# EAGLE design reLoaD_Base (EAGLE 9.7.0)
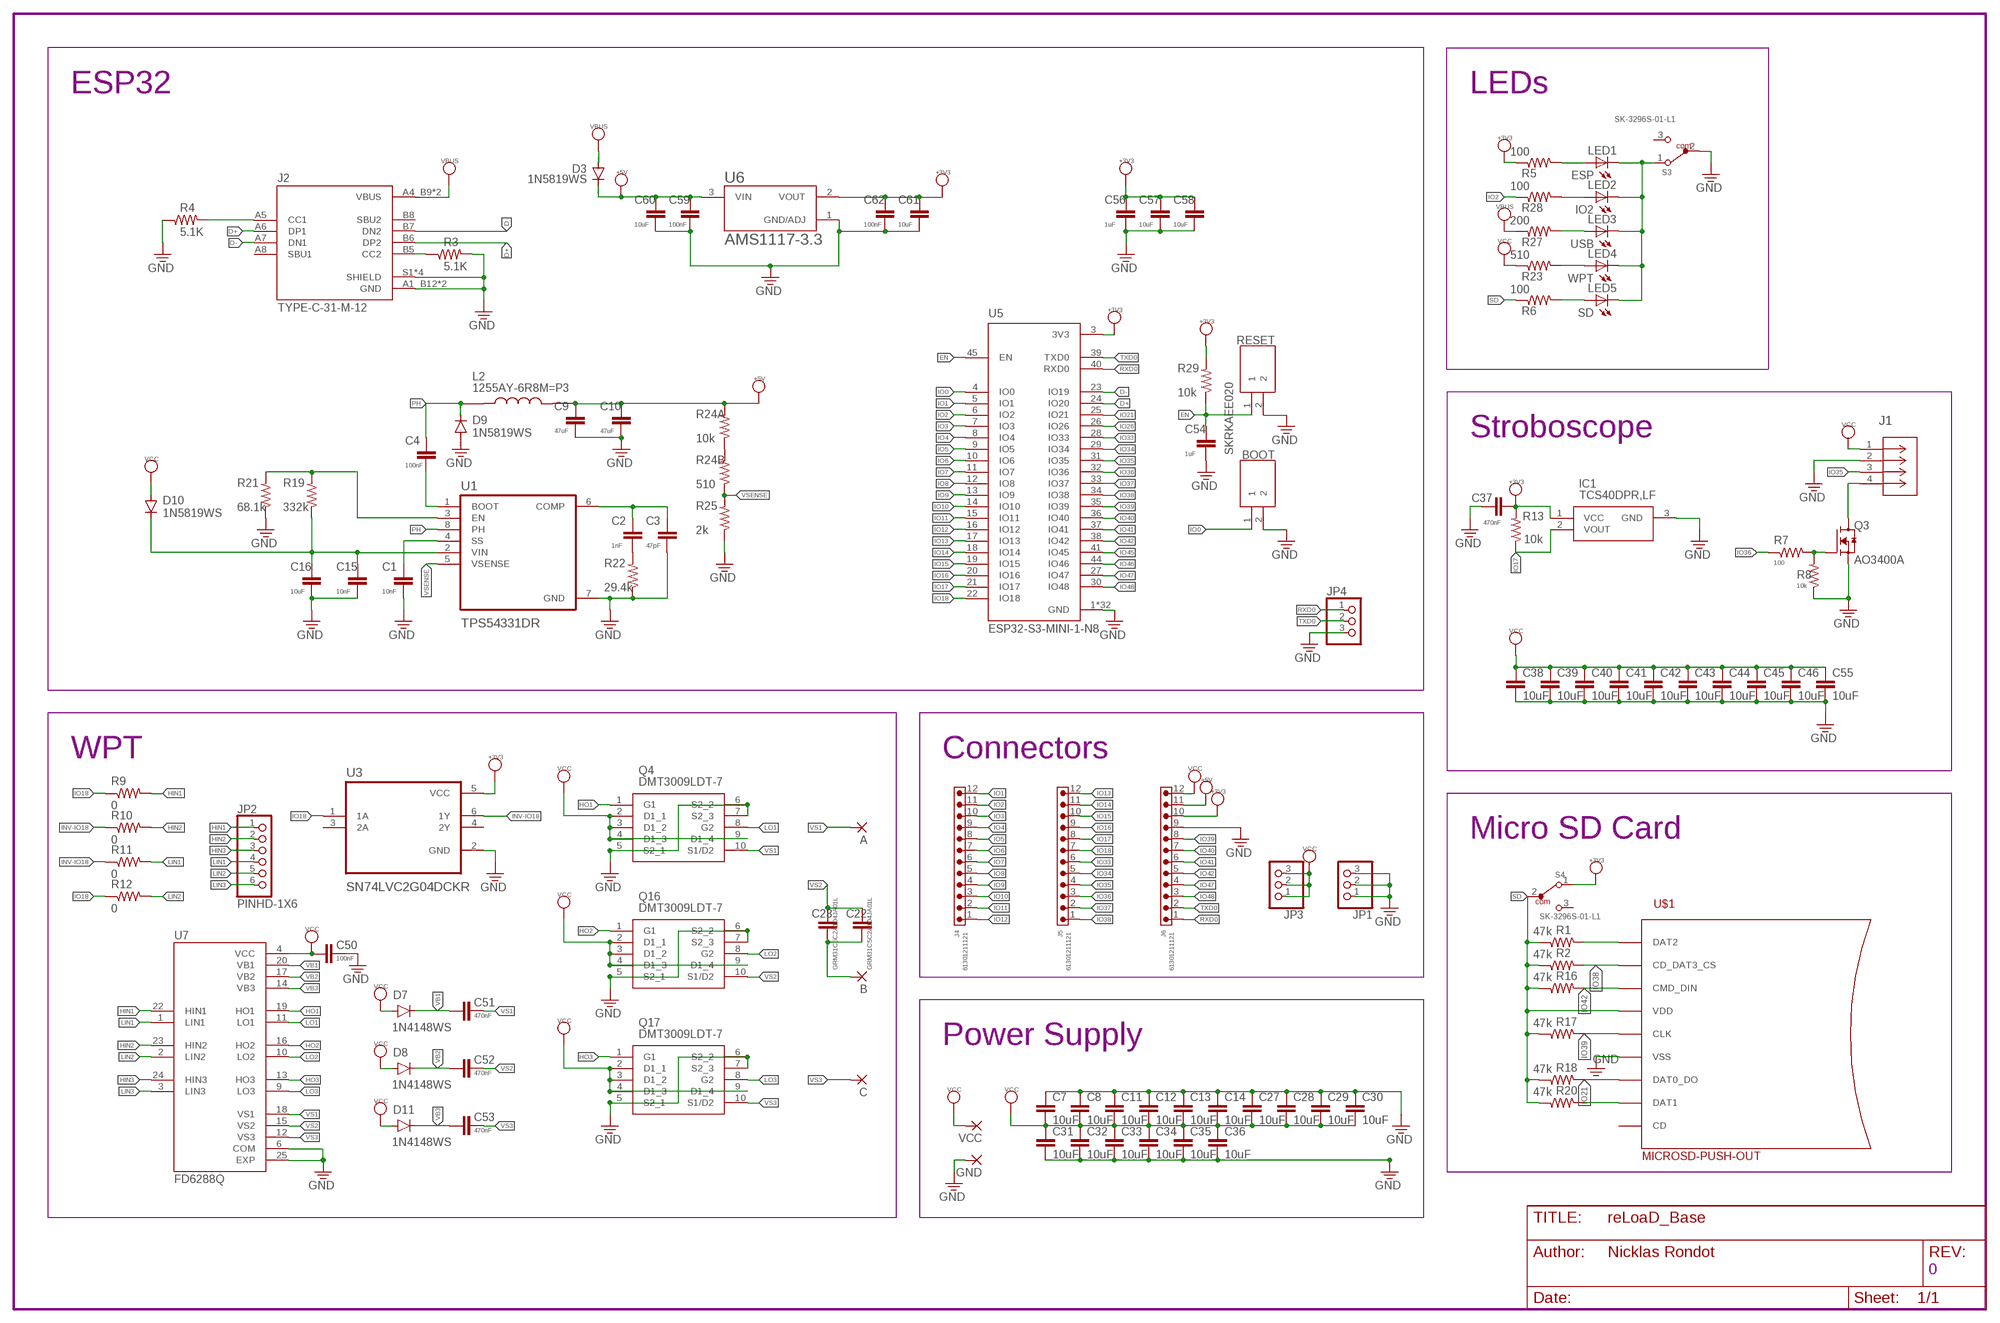
[diagram p0: schematic, sheet 1]

## Parts
A  3,81/1,4  [3,81/1,4]
B  3,81/1,4  [3,81/1,4]
BOOT  SKRKAEE020  [SKRKAEE020]
C  3,81/1,4  [3,81/1,4]
C1  10nF  C-EUC0603K  [C0603K]
C2  1nF  C-EUC0603K  [C0603K]
C3  47pF  C-EUC0603K  [C0603K]
C4  100nF  C-EUC0603K  [C0603K]
C7  10uF  C-EUC0805K  [C0805K]
C8  10uF  C-EUC0805K  [C0805K]
C9  47uF  C-EUC0603K  [C0603K]
C10  47uF  C-EUC0603K  [C0603K]
C11  10uF  C-EUC0805K  [C0805K]
C12  10uF  C-EUC0805K  [C0805K]
C13  10uF  C-EUC0805K  [C0805K]
C14  10uF  C-EUC0805K  [C0805K]
C15  10nF  C-EUC0603K  [C0603K]
C16  10uF  C-EUC0603K  [C0603K]
C22  GRM31C5C2A104JA01L  C-EUC1206K  [C1206K]
C23  GRM31C5C2A104JA01L  C-EUC1206K  [C1206K]
C27  10uF  C-EUC0805K  [C0805K]
C28  10uF  C-EUC0805K  [C0805K]
C29  10uF  C-EUC0805K  [C0805K]
C30  10uF  C-EUC0805K  [C0805K]
C31  10uF  C-EUC0805K  [C0805K]
C32  10uF  C-EUC0805K  [C0805K]
C33  10uF  C-EUC0805K  [C0805K]
C34  10uF  C-EUC0805K  [C0805K]
C35  10uF  C-EUC0805K  [C0805K]
C36  10uF  C-EUC0805K  [C0805K]
C37  470nF  C-EUC0603K  [C0603K]
C38  10uF  C-EUC0805K  [C0805K]
C39  10uF  C-EUC0805K  [C0805K]
C40  10uF  C-EUC0805K  [C0805K]
C41  10uF  C-EUC0805K  [C0805K]
C42  10uF  C-EUC0805K  [C0805K]
C43  10uF  C-EUC0805K  [C0805K]
C44  10uF  C-EUC0805K  [C0805K]
C45  10uF  C-EUC0805K  [C0805K]
C46  10uF  C-EUC0805K  [C0805K]
C50  100nF  C-EUC0603K  [C0603K]
C51  470nF  C-EUC0603K  [C0603K]
C52  470nF  C-EUC0603K  [C0603K]
C53  470nF  C-EUC0603K  [C0603K]
C54  1uF  C-EUC0603K  [C0603K]
C55  10uF  C-EUC0805K  [C0805K]
C56  1uF  C-EUC0603K  [C0603K]
C57  10uF  C-EUC0603K  [C0603K]
C58  10uF  C-EUC0603K  [C0603K]
C59  100nF  C-EUC0603K  [C0603K]
C60  10uF  C-EUC0603K  [C0603K]
C61  10uF  C-EUC0603K  [C0603K]
C62  100nF  C-EUC0603K  [C0603K]
D3  1N5819WS  DIODE-SOD323-W  [SOD323-W]
D7  1N4148WS  [SOD-323]
D8  1N4148WS  [SOD-323]
D9  1N5819WS  DIODE-SOD323-W  [SOD323-W]
D10  1N5819WS  DIODE-SOD323-W  [SOD323-W]
D11  1N4148WS  [SOD-323]
GND  3,81/1,4  [3,81/1,4]
IC1  TCS40DPR,LF  [SOTFL95P240X88-3N]
J1  S4B-XH-SM4-TBCONN4_S4B-XH_JST  [CONN4_S4B-XH_JST]
J2  TYPE-C-31-M-12  [HRO_TYPE-C-31-M-12]
J4  61301211121  6130XX11121_61301211121  [61301211121]
J5  61301211121  6130XX11121_61301211121  [61301211121]
J6  61301211121  6130XX11121_61301211121  [61301211121]
JP1  PINHD-1X3  [1X03]
JP2  PINHD-1X6  [1X06]
JP3  PINHD-1X3  [1X03]
JP4  PINHD-1X3  [1X03]
L2  1255AY-6R8M=P3  [IND_1255AY-6R8M=P3]
LED1  ESP  LEDCHIPLED_0805  [CHIPLED_0805]
LED2  IO2  LEDCHIPLED_0805  [CHIPLED_0805]
LED3  USB  LEDCHIPLED_0805  [CHIPLED_0805]
LED4  WPT  LEDCHIPLED_0805  [CHIPLED_0805]
LED5  SD  LEDCHIPLED_0805  [CHIPLED_0805]
Q3  AO3400A  [SOT95P280X125-3N]
Q4  DMT3009LDT-7  [DMT3009LDT7]
Q16  DMT3009LDT-7  [DMT3009LDT7]
Q17  DMT3009LDT-7  [DMT3009LDT7]
R1  47k  R-US_R0603  [R0603]
R2  47k  R-US_R0603  [R0603]
R3  5.1K  R-US_R0603  [R0603]
R4  5.1K  R-US_R0603  [R0603]
R5  100  R-US_R0603  [R0603]
R6  100  R-US_R0603  [R0603]
R7  100  R-US_R0603  [R0603]
R8  10k  R-US_R0603  [R0603]
R9  0  R-US_R0603  [R0603]
R10  0  R-US_R0603  [R0603]
R11  0  R-US_R0603  [R0603]
R12  0  R-US_R0603  [R0603]
R13  10k  R-US_R0603  [R0603]
R16  47k  R-US_R0603  [R0603]
R17  47k  R-US_R0603  [R0603]
R18  47k  R-US_R0603  [R0603]
R19  332k  R-US_R0603  [R0603]
R20  47k  R-US_R0603  [R0603]
R21  68.1k  R-US_R0603  [R0603]
R22  29.4k  R-US_R0603  [R0603]
R23  510  R-US_R0603  [R0603]
R24A  10k  R-US_R0603  [R0603]
R24B  510  R-US_R0603  [R0603]
R25  2k  R-US_R0603  [R0603]
R27  200  R-US_R0603  [R0603]
R28  100  R-US_R0603  [R0603]
R29  10k  R-US_R0603  [R0603]
RESET  SKRKAEE020  [SKRKAEE020]
S3  SK-3296S-01-L1  450404015514  [450404015514]
S4  SK-3296S-01-L1  450404015514  [450404015514]
U1  TPS54331DR  [SOIC127P599X175-8N]
U3  SN74LVC2G04DCKR  [SOT65P210X110-6N]
U5  ESP32-S3-MINI-1-N8  [XCVR_ESP32-S3-MINI-1-N8]
U6  AMS1117-3.3  [SOT229P700X180-4N]
U7  FD6288Q  [QFN50P400X400X90-25N]
U$1  MICROSD-PUSH-OUT  [MICROSD-PUSH-OUT]
VCC  3,81/1,4  [3,81/1,4]

## Nets
+3V3: C37.2 C56.1 C57.1 C58.1 C61.1 C62.1 IC1.1(VCC) J6.10 R5.1 R13.2 R29.2 S4.1 U3.5(VCC) U5.3(3V3) U6.2(VOUT)
+5V: C9.1 C10.1 C59.1 C60.1 D3.C J6.11 L2.2 R24A.2 U6.3(VIN)
COIL2R1: B.1(P) C22.1 C23.1
D+: J2.A6(DP1) J2.B6(DP2) U5.24(IO20)
D-: J2.A7(DN1) J2.B7(DN2) U5.23(IO19)
DAT2: R1.2 U$1.1(DAT2)
EN: C54.1 R29.1 RESET.1 U5.45(EN)
GND: BOOT.2 C1.2 C3.2 C7.1 C8.1 C9.2 C10.2 C11.1 C12.1 C13.1 C14.1 C15.2 C16.2 C27.1 C28.1 C29.1 C30.1 C31.2 C32.2 C33.2 C34.2 C35.2 C36.2 C37.1 C38.2 C39.2 C40.2 C41.2 C42.2 C43.2 C44.2 C45.2 C46.2 C50.1 C54.2 C55.2 C56.2 C57.2 C58.2 C59.2 C60.2 C61.2 C62.2 D9.A GND.1(P) IC1.3(GND) J1.2 J2.A1_B12(GND) J2.B1_A12(GND) J2.S1(SHIELD) J2.S2(SHIELD) J2.S3(SHIELD) J2.S4(SHIELD) J6.9 JP1.1 JP1.2 JP1.3 JP4.3 Q3.2(S) Q4.5(S2_1) Q4.6(S2_2) Q4.7(S2_3) Q16.5(S2_1) Q16.6(S2_2) Q16.7(S2_3) Q17.5(S2_1) Q17.6(S2_2) Q17.7(S2_3) R3.2 R4.1 R8.1 R21.1 R22.1 R25.1 RESET.2 S3.2 U1.7(GND) U3.2(GND) U5.1(GND) U5.2(GND) U5.42(GND) U5.43(GND) U5.46(GND) U5.47(GND) U5.48(GND) U5.49(GND) U5.50(GND) U5.51(GND) U5.52(GND) U5.53(GND) U5.54(GND) U5.55(GND) U5.56(GND) U5.57(GND) U5.58(GND) U5.59(GND) U5.60(GND) U5.61(GND) U5.61_1(GND) U5.61_2(GND) U5.61_3(GND) U5.61_4(GND) U5.61_5(GND) U5.61_6(GND) U5.61_7(GND) U5.61_8(GND) U5.62(GND) U5.63(GND) U5.64(GND) U5.65(GND) U6.1(GND/ADJ) U7.6(COM) U7.25(EXP) U$1.6(VSS) U$1.G1(VSS) U$1.G2(VSS) U$1.G3(VSS) U$1.G4(VSS)
HIN1: JP2.1 R9.2 U7.22(HIN1)
HIN2: JP2.2 R10.2 U7.23(HIN2)
HIN3: JP2.3 U7.24(HIN3)
HO1: Q4.1(G1) U7.19(HO1)
HO2: Q16.1(G1) U7.16(HO2)
HO3: Q17.1(G1) U7.13(HO3)
INV-IO18: R10.1 R11.1 U3.6(1Y)
IO0: BOOT.1 U5.4(IO0)
IO1: J4.12 U5.5(IO1)
IO2: J4.11 R28.1 U5.6(IO2)
IO3: J4.10 U5.7(IO3)
IO4: J4.9 U5.8(IO4)
IO5: J4.8 U5.9(IO5)
IO6: J4.7 U5.10(IO6)
IO7: J4.6 U5.11(IO7)
IO8: J4.5 U5.12(IO8)
IO9: J4.4 U5.13(IO9)
IO10: J4.3 U5.14(IO10)
IO11: J4.2 U5.15(IO11)
IO12: J4.1 U5.16(IO12)
IO13: J5.12 U5.17(IO13)
IO14: J5.11 U5.18(IO14)
IO15: J5.10 U5.19(IO15)
IO16: J5.9 U5.20(IO16)
IO17: IC1.2(VOUT) J5.8 R13.1 U5.21(IO17)
IO18: J5.7 R9.1 R12.1 U3.1(1A) U5.22(IO18)
IO21: R18.2 U5.25(IO21) U$1.7(DAT0_DO)
IO26: U5.26(IO26)
IO33: J5.6 U5.28(IO33)
IO34: J5.5 U5.29(IO34)
IO35: J1.3 J5.4 U5.31(IO35)
IO36: J5.3 R7.1 U5.32(IO36)
IO37: J5.2 U5.33(IO37)
IO38: J5.1 R2.2 U5.34(IO38) U$1.2(CD_DAT3_CS)
IO39: J6.8 R17.2 U5.35(IO39) U$1.5(CLK)
IO40: J6.7 U5.36(IO40)
IO41: J6.6 U5.37(IO41)
IO42: J6.5 R16.2 U5.38(IO42) U$1.3(CMD_DIN)
IO45: U5.41(IO45)
IO46: U5.44(IO46)
IO47: J6.4 U5.27(IO47)
IO48: J6.3 U5.30(IO48)
LIN1: JP2.4 R11.2 U7.1(LIN1)
LIN2: JP2.5 R12.2 U7.2(LIN2)
LIN3: JP2.6 U7.3(LIN3)
LO1: Q4.8(G2) U7.11(LO1)
LO2: Q16.8(G2) U7.10(LO2)
LO3: Q17.8(G2) U7.9(LO3)
N$1: LED3.A R27.2
N$2: LED4.A R23.2
N$3: J1.4 Q3.3(D)
N$4: J2.B5(CC2) R3.1
N$5: LED1.C LED2.C LED3.C LED4.C LED5.C S3.1
N$6: LED2.A R28.2
N$7: R19.2 R21.2 U1.3(EN)
N$8: C1.1 U1.4(SS)
N$9: R20.2 U$1.8(DAT1)
N$10: C2.1 C3.1 U1.6(COMP)
N$11: C2.2 R22.2
N$12: Q3.1(G) R7.2 R8.2
N$13: LED1.A R5.2
N$14: LED5.A R6.2
N$16: R24A.1 R24B.2
N$30: C4.2 U1.1(BOOT)
N$35: C15.1 C16.1 D10.C R19.1 U1.2(VIN)
N$80: J2.A5(CC1) R4.2
PH: C4.1 D9.C L2.1 U1.8(PH)
RXD0: J6.1 JP4.1 U5.40(RXD0)
SD: R1.1 R2.1 R6.1 R16.1 R17.1 R18.1 R20.1 S4.2 U$1.4(VDD)
TXD0: J6.2 JP4.2 U5.39(TXD0)
VB1: C51.1 D7.C U7.20(VB1)
VB2: C52.1 D8.C U7.17(VB2)
VB3: C53.1 D11.C U7.14(VB3)
VBUS: D3.A J2.A4_B9(VBUS) J2.B4_A9(VBUS) R27.1
VCC: C7.2 C8.2 C11.2 C12.2 C13.2 C14.2 C27.2 C28.2 C29.2 C30.2 C31.1 C32.1 C33.1 C34.1 C35.1 C36.1 C38.1 C39.1 C40.1 C41.1 C42.1 C43.1 C44.1 C45.1 C46.1 C50.2 C55.1 D7.A D8.A D10.A D11.A J1.1 J6.12 JP3.1 JP3.2 JP3.3 Q4.2(D1_1) Q4.3(D1_2) Q4.4(D1_3) Q4.9(D1_4) Q16.2(D1_1) Q16.3(D1_2) Q16.4(D1_3) Q16.9(D1_4) Q17.2(D1_1) Q17.3(D1_2) Q17.4(D1_3) Q17.9(D1_4) R23.1 U7.4(VCC) VCC.1(P)
VS1: A.1(P) C51.2 Q4.10(S1/D2) U7.18(VS1)
VS2: C22.2 C23.2 C52.2 Q16.10(S1/D2) U7.15(VS2)
VS3: C53.2 C.1(P) Q17.10(S1/D2) U7.12(VS3)
VSENSE: R24B.1 R25.2 U1.5(VSENSE)
Unconnected: J2.A8(SBU1) J2.B8(SBU2) S3.3 S4.3 U3.3(2A) U3.4(2Y) U$1.CD

## Notes on the sheet
- ESP32 | LEDs
- Stroboscope
- WPT | Connectors
- Micro SD Card
- Power Supply
- 0

## Library data of the parts
A B C GND VCC = wirepad:3,81/1,4: THROUGH-HOLE PAD
BOOT RESET = SKRKAEE020:SKRKAEE020: Tactile Switches 3.9x2.9x2.0mm 160gf Packaging Temp 80oC Source: Datasheet <http://www.alps.com/prod/info/J/HTML/Tact/SurfaceMount/SKRK/SKRKAEE020.html>; DESCRIPTION: Tactile Switches 3.9x2.9x2.0mm 160gf Packaging Temp 80oC; HEIGHT: 2mm; MANUFACTURER_NAME: ALPS Electric; MANUFACTURER_PART_NUMBER: SKRKAEE020; MOUSER_PART_NUMBER: 688-SKRKAEE020; MOUSER_PRICE-STOCK: https://www.mouser.co.uk/ProductDetail/Alps-Alpine/SKRKAEE020?qs=MrosSN5%252BUQW89XjXIp8Ugw%3D%3D
C1-C4 C9 C10 C15 C16 C37 C50-C54 C56-C62 = resistor:C-EU: CAPACITOR, European symbol
C7 C8 C11-C14 C22 C23 C27-C36 C38-C46 C55 = rcl:C-EU: CAPACITOR, European symbol; SPICEPREFIX: C
D3 D9 D10 = diode:DIODE-: DIODE
D7 D8 D11 = Diodes-2:1N4148WS: DIODE GEN PURP 75V 150MA SOD323F Manufacturer's datasheet <https://www.onsemi.com/pub/Collateral/1N914BWS-D.pdf>; CREATED_BY: PCBLayout.com; DIGIKEY_PART_NUMBER: 1N4148WSFSTR-ND; MANUFACTURER: Diodes Incorporated; MPN: 1N4148WS; PACKAGE: SOD-323
IC1 = TCS40DPR,LF:TCS40DPR,LF: Board Mount Hall Effect / Magnetic Sensors Magnetic Sensor Push Pull Dual Detection Source: Datasheet <http://toshiba.semicon-storage.com/info/docget.jsp?did=30107&prodName=TCS40DPR>; DESCRIPTION: Board Mount Hall Effect / Magnetic Sensors Magnetic Sensor Push Pull Dual Detection; HEIGHT: 0.88mm; MANUFACTURER_NAME: Toshiba; MANUFACTURER_PART_NUMBER: TCS40DPR,LF; MOUSER_PART_NUMBER: 757-TCS40DPRLF; MOUSER_PRICE-STOCK: https://www.mouser.co.uk/ProductDetail/Toshiba/TCS40DPRLF?qs=GSXfdiLIrOHqR%252B5sANTKJA%3D%3D
J1 = CONN4_S4B-XH_JST:S4B-XH-SM4-TB; COPYRIGHT: Copyright (C) 2024 Ultra Librarian. All rights reserved.; MANUFACTURER_PART_NUMBER: S4B-XH-SM4-TB; MFR_NAME: JST; TYPE: Headers, Male Pins
J2 = TYPE-C-31-M-12:TYPE-C-31-M-12: Check availability <https://pricing.snapeda.com/parts/TYPE-C-31-M-12/HRO%20Electronics%20Co.%2C%20Ltd./view-part?ref=eda>; AVAILABILITY: Not in stock; DESCRIPTION: USB Connectors 24 Receptacle 1 8.94*7.3mm RoHS; MF: HRO Electronics Co., Ltd.; MP: TYPE-C-31-M-12; PACKAGE: Package; PRICE: None
J4-J6 = Wurth_Connectors_WR-PHD:6130XX11121_61301211121: WR-PHD 2.54 mm THT Pin Header ARTICLE PROPERTIES: Pins:1;​ 2;​ 3;​ 4;​ 5;​ 6;​ 7;​ 8;​ 9;​ 10;​ 12;​ 13;​ 14;​ 15;​ 16;​ 18;​ 20;​ 22;​ 24;​ 25;​ 32;​ 36;​ 40 KIND PROPERTIES: Pitch：2.54 mm Quality Class:3 as per CECC 75 301-802 Rows：Single Gender：Pin Header Type：Straight MATERIAL PROPERTIES: Insulator Material PA6T; PBT Insulator Flammability Rating:UL94 V-0 Contact Material:Copper Alloy Contact Plating:Gold Contact Type:Stamped GENERAL INFORMATION Operating Temperature:-40 up to +105 °C ELECTRICAL PROPERTIES: Withstanding Voltage 500 V (AC) Contact Resistance 20 mΩ RISO 1000 MΩ CERTIFICATION UL Approval:E323964 PACKAGING PROPERTIES Packaging:Bag <https://www.we-online.com/catalog/media/o33211v209%20Family_BTB_PHD_6130xx11121.jpg> Details see: https://www.we-online.com/katalog/en/em/PHD_2_54_THT_PIN_HEADER_6130XX11121 Updated by Ella Wu 2021-12-08 2021 (C) Würth Elektronik; DATASHEET-URL: https://www.we-online.com/redexpert/spec/61301211121?ae; GENDER: Pin Header; IR: 3A; MOUNT: THT; PACKAGING: Bag; PART-NUMBER: 61301211121; PINS: 12; PITCH: 2.54mm; ROWS: Single; TYPE: Straight
JP1 JP3 JP4 = pinhead:PINHD-1X3: PIN HEADER
JP2 = Connector:PINHD-1X6: PIN HEADER; CATEGORY: CONNECTOR; SUB-CATEGORY: PIN-HEADER
L2 = 1255AY-6R8M=P3:1255AY-6R8M=P3: 3.9µH Shielded Wirewound Inductor 4.2A 26.4mOhm Max Nonstandard Check availability <https://pricing.snapeda.com/parts/1255AY-6R8M%3DP3/Murata%20Electronics/view-part?ref=eda>; AVAILABILITY: Not in stock; CHECK_PRICES: https://www.snapeda.com/parts/1255AY-6R8M=P3/Murata+Electronics+North+America/view-part/?ref=eda; DESCRIPTION: 6.8 µH Shielded Drum Core, Wirewound Inductor 3.4 A 36mOhm Nonstandard; MF: Murata Electronics; MP: 1255AY-6R8M=P3; PACKAGE: NONSTANDARD; PRICE: None; PURCHASE-URL: https://www.snapeda.com/api/url_track_click_mouser/?unipart_id=1508412&manufacturer=Murata Electronics&part_name=1255AY-6R8M=P3&search_term=1255ay-6r8m=p3; SNAPEDA_LINK: https://www.snapeda.com/parts/1255AY-6R8M=P3/Murata+Electronics+North+America/view-part/?ref=snap
LED1-LED5 = adafruit:LED: LED OSRAM: - CHIPLED LG R971, LG N971, LY N971, LG Q971, LY Q971, LO R971, LY R971 LH N974, LH R974 LS Q976, LO Q976, LY Q976 LO Q996 - Hyper CHIPLED LW Q18S LB Q993, LB Q99A, LB R99A - SideLED LS A670, LO A670, LY A670, LG A670, LP A670 LB A673, LV A673, LT A673, LW A673 LH A674 LY A675 LS A676, LA A676, LO A676, LY A676, LW A676 LS A679, LY A679, LG A679 - Hyper Micro SIDELED® LS Y876, LA Y876, LO Y876, LY Y876 LT Y87S - SmartLED LW L88C, LW L88S LB L89C, LB L89S, LG L890 LS L89K, LO L89K, LY L89K LS L896, LA L896, LO L896, LY L896 - TOPLED LS T670, LO T670, LY T670, LG T670, LP T670 LSG T670, LSP T670, LSY T670, LOP T670, LYG T670 LG T671, LOG T671, LSG T671 LB T673, LV T673, LT T673, LW T673 LH T674 LS T676, LA T676, LO T676, LY T676, LB T676, LH T676, LSB T676, LW T676 LB T67C, LV T67C, LT T67C, LS T67K, LO T67K, LY T67K, LW E67C LS E67B, LA E67B, LO E67B, LY E67B, LB E67C, LV E67C, LT E67C LW T67C LS T679, LY T679, LG T679 LS T770, LO T770, LY T770, LG T770, LP T770 LB T773, LV T773, LT T773, LW T773 LH T774 LS E675, LA E675, LY E675, LS T675 LS T776, LA T776, LO T776, LY T776, LB T776 LHGB T686 LT T68C, LB T68C - Hyper Mini TOPLED® LB M676 - Mini TOPLED Santana® LG M470 LS M47K, LO M47K, LY M47K Source: http://www.osram.convergy.de/
Q3 = AO3400A:AO3400A: Trans MOSFET N-CH 30V 5.7A 3-Pin SOT-23; CHECK_PRICES: https://www.snapeda.com/parts/AO3400A/Alpha+%2526+Omega+Semiconductor+Inc./view-part/?ref=eda; DESCRIPTION: N-Channel 30 V 5.7A (Ta) 1.4W (Ta) Surface Mount SOT-23-3; DIGIKEY_PART_NUMBER: 785-1000-2-ND; MF: Alpha &; MP: AO3400A; PACKAGE: SOT-23 Alpha &amp; Omega Semiconductor; PURCHASE-URL: https://www.snapeda.com/api/url_track_click_mouser/?unipart_id=405248&manufacturer=Alpha &amp;&part_name=AO3400A&search_term=ao3400a; SNAPEDA_LINK: https://www.snapeda.com/parts/AO3400A/Alpha+%2526+Omega+Semiconductor+Inc./view-part/?ref=snap
Q4 Q16 Q17 = DMT3009LDT-7:DMT3009LDT-7: Trans MOSFET N-CH 30V 30A 8-Pin VDFN T/R Source: Datasheet <https://www.diodes.com/assets/Datasheets/DMT3009LDT.pdf>; DESCRIPTION: Trans MOSFET N-CH 30V 30A 8-Pin VDFN T/R; HEIGHT: 0.85mm; MANUFACTURER_NAME: Diodes Incorporated; MANUFACTURER_PART_NUMBER: DMT3009LDT-7; MOUSER_PART_NUMBER: 621-DMT3009LDT-7; MOUSER_PRICE-STOCK: https://www.mouser.co.uk/ProductDetail/Diodes-Incorporated/DMT3009LDT-7?qs=60RJRzIpcl%2Fbs7PsZRGw9g%3D%3D
R1-R13 R16-R23 R24A R24B R25 R27-R29 = resistor:R-US_: RESISTOR, American symbol
S3 S4 = Wurth_Switch_WS-SLSU:450404015514: WS-SLSU Mini Slide Switch, Same Side Connection Side Push 6.7x2.7 mm Properties Actuator Material:PA46 Actuator Flammability Rating:UL94 HB Actuator Color:Black Frame Material:LCP Frame Flammability Rating:UL94 V-0 Frame Color:Black Contact Material:Copper Alloy Contact Plating:Silver Terminal Material:Copper Alloy Terminal Plating:Silver Switching Function:On-On Schematic:SPDT Connection Type:Same Side Connection Qty.:3300 Material Properties Cover Material:Stainless Steel General Information Operating Temperature:-40 up to +85 °C Packaging Properties Packaging :Tape and Reel <https://www.we-online.com/catalog/media/o76706v209%20Family_WS-SLSU_Gruppe.jpg> Details see: https://www.we-online.com/catalog/en/SLSU_6_7X_2_7_SMD_HORIZONTAL/ Updated by yingchun,Shan;2020-02-25 2020(C) Würth Elektronik; DATASHEET-URL: https://www.we-online.com/catalog/datasheet/450404015514.pdf; IR: 300mA; PACKAGING: Tape and Reel; PART-NUMBER: 450404015514; QTY: 150; VR: 5V(DC)
U1 = TPS54331DR:TPS54331DR: Check availability <https://pricing.snapeda.com/parts/TPS54331DR/Texas%20Instruments/view-part?ref=eda>; AVAILABILITY: In Stock; CHECK_PRICES: https://www.snapeda.com/parts/TPS54331DR/Texas+Instruments/view-part/?ref=eda; DESCRIPTION: 3.5V to 28V Input, 3A, 570kHz Step-Down Converter with Eco-mode; MF: Texas Instruments; MP: TPS54331DR; PACKAGE: SOIC-8 Texas Instruments; PRICE: None; PURCHASE-URL: https://www.snapeda.com/api/url_track_click_mouser/?unipart_id=490779&manufacturer=Texas Instruments&part_name=TPS54331DR&search_term=tps54331dr; SNAPEDA_LINK: https://www.snapeda.com/parts/TPS54331DR/Texas+Instruments/view-part/?ref=snap
U3 = SN74LVC2G04DCKR:SN74LVC2G04DCKR: Check availability <https://pricing.snapeda.com/parts/SN74LVC2G04DCKR/Texas%20Instruments/view-part?ref=eda>; AVAILABILITY: In Stock; CHECK_PRICES: https://www.snapeda.com/parts/SN74LVC2G04DCKR/Texas+Instruments/view-part/?ref=eda; DESCRIPTION: 2-ch, 1.65-V to 5.5-V inverters; MF: Texas Instruments; MP: SN74LVC2G04DCKR; PACKAGE: SOT-SC70-6 Texas Instruments; PRICE: None; PURCHASE-URL: https://www.snapeda.com/api/url_track_click_mouser/?unipart_id=386869&manufacturer=Texas Instruments&part_name=SN74LVC2G04DCKR&search_term=sn74lvc2g04; SNAPEDA_LINK: https://www.snapeda.com/parts/SN74LVC2G04DCKR/Texas+Instruments/view-part/?ref=snap
U5 = ESP32-S3-MINI-1-N8:ESP32-S3-MINI-1-N8: Bluetooth, WiFi 802.11b/g/n, Bluetooth v5.0 Transceiver Module 2.4GHz PCB Trace Surface Mount Check availability <https://pricing.snapeda.com/parts/ESP32-S3-MINI-1-N8/Espressif%20Systems/view-part?ref=eda>; AVAILABILITY: In Stock; CHECK_PRICES: https://www.snapeda.com/parts/ESP32-S3-MINI-1-N8/Espressif+Systems/view-part/?ref=eda; DESCRIPTION: Bluetooth, WiFi 802.11b/g/n, Bluetooth v5.0 Transceiver Module 2.4GHz PCB Trace Surface Mount; MF: Espressif Systems; MP: ESP32-S3-MINI-1-N8; PACKAGE: None; PRICE: None; PURCHASE-URL: https://www.snapeda.com/api/url_track_click_mouser/?unipart_id=8941370&manufacturer=Espressif Systems&part_name=ESP32-S3-MINI-1-N8&search_term= esp32-s3-mini-1-n8; SNAPEDA_LINK: https://www.snapeda.com/parts/ESP32-S3-MINI-1-N8/Espressif+Systems/view-part/?ref=snap
U6 = AMS1117-3.3:AMS1117-3.3: Check availability <https://pricing.snapeda.com/parts/AMS1117-3.3/Advanced%20Monolithic%20Systems/view-part?ref=eda>; AVAILABILITY: Not in stock; CHECK_PRICES: https://www.snapeda.com/parts/AMS1117-3.3/Advanced+Monolithic+Systems/view-part/?ref=eda; DESCRIPTION: Sot223/Pkg 1-Amp 3.3-Volt Low Drop Out Voltage Regulatator; MF: Advanced Monolithic Systems; MP: AMS1117-3.3; PACKAGE: SOT-223 Seeed Technology; PRICE: None; SNAPEDA_LINK: https://www.snapeda.com/parts/AMS1117-3.3/Advanced+Monolithic+Systems/view-part/?ref=snap
U7 = FD6288Q:FD6288Q: MOS Drivers QFN-24 Check availability <https://pricing.snapeda.com/parts/FD6288Q/Fortior%20Tech/view-part?ref=eda>; AVAILABILITY: Not in stock; CHECK_PRICES: https://www.snapeda.com/parts/FD6288Q/Fortior+Tech/view-part/?ref=eda; DESCRIPTION: MOS Drivers QFN-24; MF: Fortior Tech; MP: FD6288Q; PACKAGE: Package; PRICE: None; SNAPEDA_LINK: https://www.snapeda.com/parts/FD6288Q/Fortior+Tech/view-part/?ref=snap
U$1 = TF-012-P9:MICROSD-PUSH-OUT: T-Flash Push-Out Micro SD Card Reader 14.75mm x 14.5mm SMD with external pins

## Board
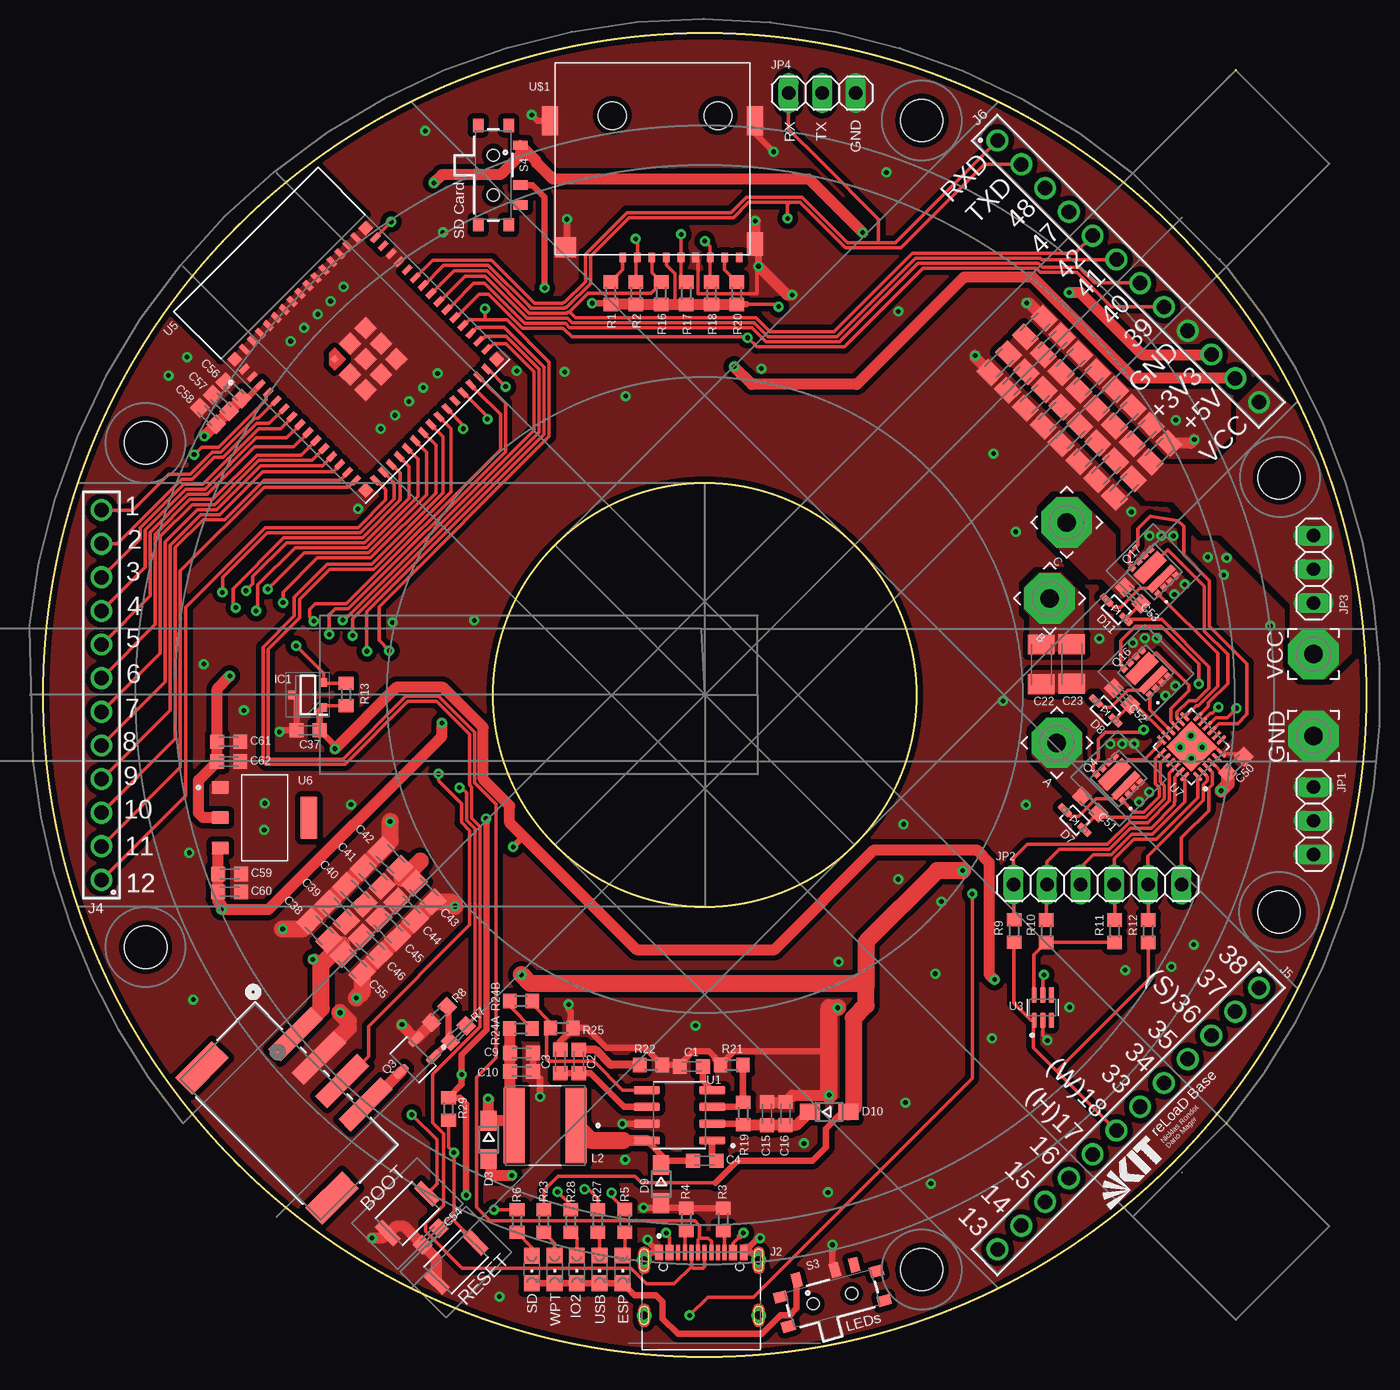
[diagram p1: board, top side]
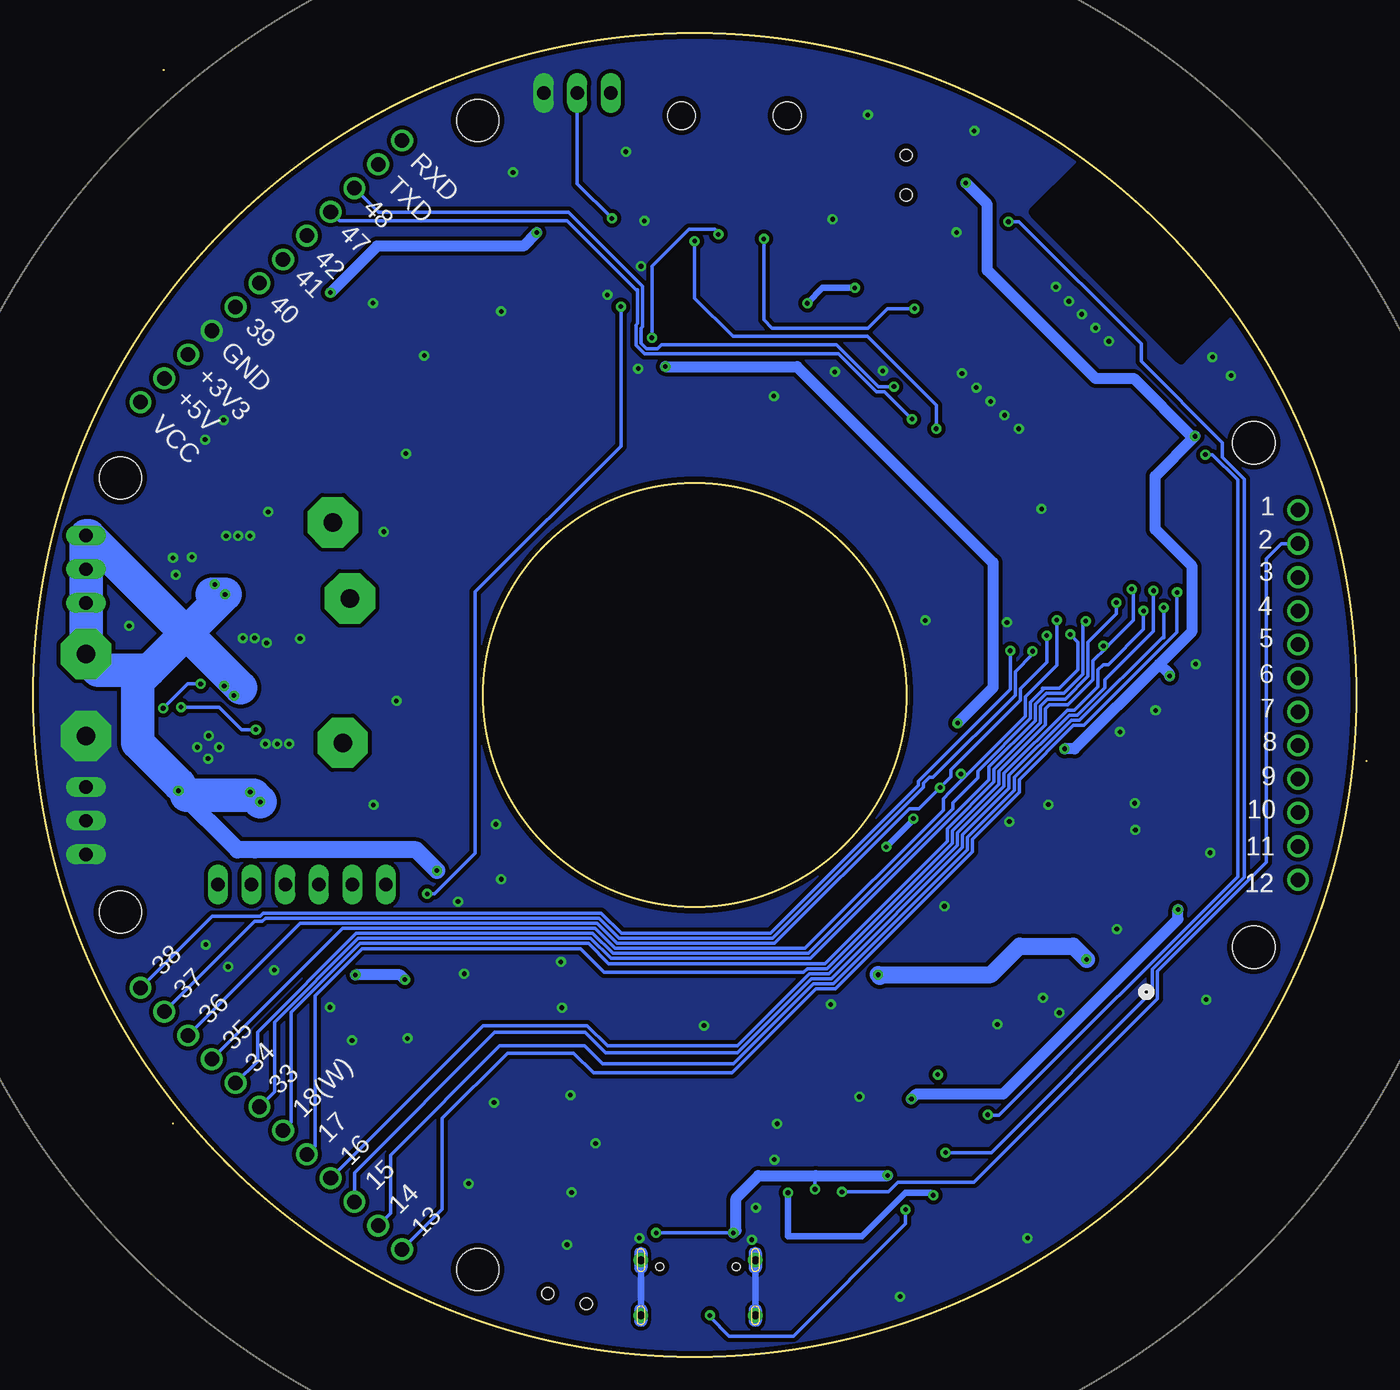
[diagram p2: board, bottom side, seen from below]

Size 100.76 x 100 mm. Coordinates in mm from the lower left corner, seen from the top.
Outline: 90.19,17.64 90.19,17.64
Outline: 90.88,97.2 90.89,97.2
Outline: 0,45 0,45.01
Outline: circle at 50.76,50 radius 16
Outline: circle at 50.76,50 radius 50
Copper layers (1*16): Top 0.035mm / dielectric 1.5mm / Bottom 0.035mm
Design rules "Fusion Electronics Design Rules": minimum track width 6mil, minimum drill 0.35mm, track to track 5mil, track to pad 5mil, pad to pad 5mil, via to via 0.5mm, smd to smd 5mil, copper to edge 0.4mm, drill to drill 0.5mm, minimum pad ring 10mil, minimum via ring 8mil, stop-mask expansion 4mil, vias tented up to drill 0mil, thermal gap 10mil
Holes 3.2 mm at 67.16,6.6 8.51,69.05 8.51,30.95 67.16,93.4 94.16,33.6 94.16,66.4
bRestrict: area 10.4,75.4 to 25.2,90.1

### Footprints (pad centres in the part's own frame; a part is rotated, then mirrored left to right if it is on the bottom)
3,81/1,4 = drill 1.397 pad 3.81 octagon: 1 0,0
SKRKAEE020 = smd 0.8 x 2: 1 -2.1,0; 2 2.1,0
C0603K = smd 1.05 x 1.08: 1 -0.875,0; 2 0.875,0
C0805K = smd 1.3 x 1.6: 1 -1,0; 2 1,0
C1206K = smd 1.5 x 2: 1 -1.5,0; 2 1.5,0
SOD323-W = smd 1.5 x 1.2: A 1.45,0; C -1.45,0
SOD-323 = smd 1.14 x 0.52: A 1.04,0; C -1.04,0
SOTFL95P240X88-3N = smd 0.575 x 0.62: 1 -1.188,0.95; 2 -1.188,-0.95; 3 1.188,0
CONN4_S4B-XH_JST = smd 1.295 x 4.496: 1 3.75,-4.55; 2 1.25,-4.55; 3 -1.25,-4.55; 4 -3.75,-4.55 | smd 1.803 x 3.912: 5 -6.95,2.24; 6 6.95,2.24
HRO_TYPE-C-31-M-12 = smd 0.6 x 1.14: A1_B12 -3.2,4.75; A4_B9 -2.4,4.75; B1_A12 3.2,4.75; B4_A9 2.4,4.75 | smd 0.3 x 1.14: A5 -1.25,4.75; A6 -0.25,4.75; A7 0.25,4.75; A8 1.25,4.75; B5 1.75,4.75; B6 0.75,4.75; B7 -0.75,4.75; B8 -1.75,4.75 | drill 0.6 pad 0.9: S1 -4.325,4.17; S2 4.325,4.17; S3 -4.325,0; S4 4.325,0 | hole 0.6: -2.89,3.68; 2.89,3.68
61301211121 = drill 1.1: 1 -13.97,0; 2 -11.43,0; 3 -8.89,0; 4 -6.35,0; 5 -3.81,0; 6 -1.27,0; 7 1.27,0; 8 3.81,0; 9 6.35,0; 10 8.89,0; 11 11.43,0; 12 13.97,0
1X03 = drill 1.016 long: 1 -2.54,0; 2 0,0; 3 2.54,0
1X06 = drill 1.016 long: 1 -6.35,0; 2 -3.81,0; 3 -1.27,0; 4 1.27,0; 5 3.81,0; 6 6.35,0
IND_1255AY-6R8M=P3 = smd 1.6 x 5.7: 1 -2.35,0; 2 2.35,0
CHIPLED_0805 = smd 1.2 x 1.2: A 0,-1.05; C 0,1.05
SOT95P280X125-3N = smd 1.21 x 0.59: 1 -1.255,0.95; 2 -1.255,-0.95; 3 1.255,0
DMT3009LDT7 = smd 0.45 x 0.45: 1 -0.975,-1.375; 2 -0.325,-1.375; 3 0.325,-1.375; 4 0.975,-1.375; 5 0.975,1.375; 6 0.325,1.375; 7 -0.325,1.375; 8 -0.975,1.375 | smd 2.55 x 0.566: 9 0,-0.761 | smd 2.55 x 1.044: 10 0,0.433
R0603 = smd 1 x 1.1: 1 -0.85,0; 2 0.85,0
450404015514 = smd 0.7 x 1.1: 1 2.25,-2.05; 2 -0.75,-2.05; 3 -2.25,-2.05 | smd 1 x 0.8: Z1 -3.75,1.15; Z2 3.75,1.15; Z3 3.75,-1.15; Z4 -3.75,-1.15 | hole 0.9: -1.5,0; 1.5,0
SOIC127P599X175-8N = smd 1.97 x 0.6: 1 -2.47,1.905; 2 -2.47,0.635; 3 -2.47,-0.635; 4 -2.47,-1.905; 5 2.47,-1.905; 6 2.47,-0.635; 7 2.47,0.635; 8 2.47,1.905
SOT65P210X110-6N = smd 1.19 x 0.4: 1 -0.96,0.65; 2 -0.96,0; 3 -0.96,-0.65; 4 0.96,-0.65; 5 0.96,0; 6 0.96,0.65
XCVR_ESP32-S3-MINI-1-N8 = smd 0.8 x 0.4: 1 -7,5.95; 2 -7,5.1; 3 -7,4.25; 4 -7,3.4; 5 -7,2.55; 6 -7,1.7; 7 -7,0.85; 8 -7,0; 9 -7,-0.85; 10 -7,-1.7; 11 -7,-2.55; 12 -7,-3.4; 13 -7,-4.25; 14 -7,-5.1; 15 -7,-5.95; 31 7,-5.95; 32 7,-5.1; 33 7,-4.25; 34 7,-3.4; 35 7,-2.55; 36 7,-1.7; 37 7,-0.85; 38 7,0; 39 7,0.85; 40 7,1.7; 41 7,2.55; 42 7,3.4; 43 7,4.25; 44 7,5.1; 45 7,5.95 | smd 0.4 x 0.8: 16 -5.95,-7; 17 -5.1,-7; 18 -4.25,-7; 19 -3.4,-7; 20 -2.55,-7; 21 -1.7,-7; 22 -0.85,-7; 23 0,-7; 24 0.85,-7; 25 1.7,-7; 26 2.55,-7; 27 3.4,-7; 28 4.25,-7; 29 5.1,-7; 30 5.95,-7; 46 5.95,7; 47 5.1,7; 48 4.25,7; 49 3.4,7; 50 2.55,7; 51 1.7,7; 52 0.85,7; 53 0,7; 54 -0.85,7; 55 -1.7,7; 56 -2.55,7; 57 -3.4,7; 58 -4.25,7; 59 -5.1,7; 60 -5.95,7 | smd 1.2 x 1.2: 61 0,0; 61_2 0,1.65; 61_3 1.65,1.65; 61_4 1.65,0; 61_5 1.65,-1.65; 61_6 0,-1.65; 61_7 -1.65,-1.65; 61_8 -1.65,0 | smd 0.4 x 0.4: 61_1 -1.65,1.65 | smd 0.8 x 0.8: 62 -7,7; 63 -7,-7; 64 7,-7; 65 7,7
SOT229P700X180-4N = smd 1.31 x 0.93: 1 -3.345,2.29; 2 -3.345,0; 3 -3.345,-2.29 | smd 1.31 x 3.24: 4 3.345,0
QFN50P400X400X90-25N = smd 0.83 x 0.27: 1 -1.94,1.25; 2 -1.94,0.75; 3 -1.94,0.25; 4 -1.94,-0.25; 5 -1.94,-0.75; 6 -1.94,-1.25; 13 1.94,-1.25; 14 1.94,-0.75; 15 1.94,-0.25; 16 1.94,0.25; 17 1.94,0.75; 18 1.94,1.25 | smd 0.27 x 0.83: 7 -1.25,-1.94; 8 -0.75,-1.94; 9 -0.25,-1.94; 10 0.25,-1.94; 11 0.75,-1.94; 12 1.25,-1.94; 19 1.25,1.94; 20 0.75,1.94; 21 0.25,1.94; 22 -0.25,1.94; 23 -0.75,1.94; 24 -1.25,1.94 | smd 2.7 x 2.7: 25 0,0
MICROSD-PUSH-OUT = smd 0.5 x 0.75: 1 9.625,0.225; 2 8.525,0.225; 3 7.425,0.225; 4 6.325,0.225; 5 5.225,0.225; 6 4.125,0.225; 7 3.025,0.225; 8 1.925,0.225; CD 0.825,0.225 | smd 1.2 x 1.8: G1 -0.375,-0.8 | smd 1.2 x 2.2: G2 -0.375,-10.1; G4 15.125,-10.1 | smd 1.6 x 1.5: G3 13.95,-0.55 | hole 2.1: 2.429,-10.496; 10.419,-10.495

### Placement (x,y rotation side)
A  77.36,46.39 135 top
B  76.82,57.3 135 top
BOOT  28.28,10.84 225 top
C  78.12,63.04 135 top
C1  49.74,21.93 180 top
C2  41.23,22.31 90 top
C3  39.84,22.31 90 top
C4  50.76,14.82 0 top
C7  73.01,75.07 45 top
C8  74.36,73.72 45 top
C9  36.91,22.95 0 top
C10  36.91,21.55 0 top
C11  75.7,72.37 45 top
C12  77.05,71.03 45 top
C13  78.4,69.68 45 top
C14  79.74,68.33 45 top
C15  55.46,18.38 90 top
C16  56.85,18.38 90 top
C22  76.18,52.31 270 top
C23  78.49,52.34 270 top
C27  81.09,66.98 45 top
C28  82.44,65.64 45 top
C29  75.7,77.76 225 top
C30  77.05,76.41 225 top
C31  78.4,75.07 45 top
C32  79.74,73.72 45 top
C33  81.09,72.37 45 top
C34  82.44,71.03 45 top
C35  83.79,69.68 45 top
C36  85.13,68.31 45 top
C37  20.79,47.33 0 top
C38  21.62,32.22 135 top
C39  22.97,33.56 135 top
C40  24.31,34.91 135 top
C41  25.66,36.26 135 top
C42  27.01,37.61 135 top
C43  29.53,35.07 315 top
C44  28.18,33.73 315 top
C45  26.84,32.38 315 top
C46  25.49,31.03 315 top
C50  90.88,44.73 225 top
C51  79.88,41.72 135 top
C52  82.3,49.89 135 top
C53  83.11,57.53 135 top
C54  30.04,9.08 225 top
C55  24.14,29.69 315 top
C56  15.15,73.01 135 top
C57  14.19,72.05 135 top
C58  13.22,71.08 135 top
C59  14.85,36.49 0 top
C60  14.85,35.13 0 top
C61  14.79,46.47 0 top
C62  14.79,44.97 0 top
D3  34.43,16.4 270 top
D7  78.71,40.55 135 top
D8  81.05,48.82 135 top
D9  47.46,13.04 270 top
D10  60.16,18.5 0 top
D11  81.85,56.45 135 top
GND  96.76,46.91 0 top
IC1  20.76,50 180 top
J1  19.26,18.5 135 top
J2  50.5,3.14 0 top
J4  5.17,50 90 top
J5  82.76,18 225 top
J6  82.76,82 315 top
JP1  96.76,40.5 270 top
JP2  80.44,35.67 0 top
JP3  96.76,59.5 270 top
JP4  59.63,95.47 0 top
L2  38.69,17.49 180 top
LED1  44.55,6.6 180 top
LED2  41.09,6.6 180 top
LED3  42.81,6.6 180 top
LED4  39.42,6.6 180 top
LED5  37.69,6.6 180 top
Q3  28.71,22.44 225 top
Q4  82.03,43.7 45 top
Q16  84.1,51.69 45 top
Q17  84.73,59.32 45 top
R1  43.65,80.35 90 top
R2  45.55,80.35 90 top
R3  52.15,10.38 90 top
R4  49.36,10.38 270 top
R5  44.72,10.27 270 top
R6  36.57,10.26 270 top
R7  32.12,24.42 225 top
R8  30.68,25.85 45 top
R9  74.13,32.17 90 top
R10  76.56,32.16 90 top
R11  81.73,32.14 90 top
R12  84.27,32.16 90 top
R13  23.66,50.04 270 top
R16  47.46,80.35 90 top
R17  49.36,80.35 90 top
R18  51.27,80.35 90 top
R19  53.68,18.38 90 top
R20  53.17,80.35 90 top
R21  52.79,22.06 0 top
R22  46.69,22.06 180 top
R23  38.6,10.26 270 top
R24A  36.86,24.79 180 top
R24B  36.88,26.89 180 top
R25  39.96,24.85 180 top
R27  42.68,10.26 270 top
R28  40.65,10.26 270 top
R29  31.4,18.73 90 top
RESET  31.96,7.16 225 top
S3  60.41,4.39 195 top
S4  34.79,89.27 90 top
U1  48.85,18.25 180 top
U3  76.3,26.39 90 top
U5  25.12,75.37 45 top
U6  17.5,40.73 0 top
U7  87.53,46.1 135 top
U$1  54.19,83.27 180 top
VCC  96.76,53.09 0 top

### Tracks (layer width: path | path; a pad name or v marks a point on that pad's centre or on a via)
+3V3  (via drill 0.35)
  Top 0.254: v43.71,12.4 43.71,12.13 R5.1 | v76.4,28.86 76.3,28.75 U3.5 | IC1.1 22.08,49.19 R13.2
  Top 0.508: v22.82,45.94 22.82,46.18 C37.2 21.66,48.86 IC1.1 | v32.74,12.2 32.74,19.1 32.25,19.58 R29.2 32.39,20.58 v32.39,21.32 32.39,22.83 34.27,24.71 34.27,40.63 v34.23,40.66 | 36.92,39.44 36.92,39.16 v36.28,38.52 | U5.3 16.12,72.39 C56.1
  Top 0.813: v62.7,84.92 58.63,88.99 39.26,88.99 38.04,90.21 38.04,90.32 S4.1 36.84,90.81 35.33,89.31 30.89,89.31 v30.27,88.68 | v78.29,80.39 79.14,80.39 83.82,75.72 J6.10 | U6.2 12.85,40.73 12.51,41.07 12.51,43.56 C62.1 C61.1 13.92,50.48 v14.87,51.44 | v12.95,69.55 12.95,69.58 C58.1 14.8,71.43 C57.1 C56.1 | v22.82,45.94 27.45,50.57 31,50.57 34.02,47.55 34.02,43.64 36.03,41.63 36.03,40.34 36.92,39.44 45.6,30.76 56.03,30.76 63.56,38.29 71.32,38.29 72.25,37.36 72.25,28.91 v72.65,28.5
  Bottom 0.508: v43.71,12.4 43.71,9.12 38.12,9.12 34.82,12.41 32.95,12.41 v32.74,12.2 | v36.28,38.52 34.23,40.56 v34.23,40.66
  Bottom 0.813: v22.82,45.94 22.06,45.94 15.65,52.34 | 15.65,52.34 13.17,54.83 13.17,59.72 15.96,62.52 15.96,66.53 v12.95,69.55 13.22,69.55 17.59,73.91 20.48,73.91 28.65,82.08 28.65,87.06 v30.27,88.68 | v62.7,84.92 63.71,83.91 74.77,83.91 v78.29,80.39 | v14.87,51.44 14.87,51.55 15.65,52.34 | v72.65,28.5 73.01,28.86 v76.4,28.86
+5V  (via drill 0.35)
  Top 0.813: R24A.2 36.04,24.77 C9.1 C10.1 36.04,18.96 36.01,18.94 36.01,17.82 L2.2 35.98,17.85 D3.C 34.43,19.44 v34.39,19.48 | U6.3 13.98,38.27 C59.1 C60.1 13.98,34.39 14.24,34.12 v14.24,33.78 17.78,33.78 30.89,46.9 v30.89,47.88 | v52.98,74.8 54.31,73.47 62.25,73.47 70.34,81.56 75.55,81.56 77.63,79.48 83.19,73.92 J6.11
  Bottom 0.813: v34.39,19.48 33.99,19.88 27.44,19.88 14.24,33.07 v14.24,33.78 | v52.98,74.8 43.02,74.8 28.21,59.99 28.21,50.56 v30.89,47.88
COIL2R1
  pour Top (no thermals): 75.32,56.08 75.33,56.05 75.33,53.35 79.38,53.35 79.38,57.46 77.66,59.19 76.04,59.19 74.91,58.06 74.91,56.48
D+
  Top 0.254: J2.A6 50.25,8.86 50.38,8.98 | 50.38,8.98 51.01,8.98 51.25,8.74 J2.B6 | 50.38,8.98 50.38,9.92 50.02,10.28 34.54,10.28 33.52,11.3 33.52,21.14 34.99,22.61 34.99,41.73 33.36,43.36 33.36,47.19 30.64,49.91 28.16,49.91 23.41,45.16 17.75,45.16 17.75,53.47 20.13,55.84 20.13,57.24 22.4,59.51 25.74,59.51 31.59,65.36 31.59,70.11 30.7,71.01 30.68,71.01 U5.24
D-
  Top 0.254: 49.75,6.81 J2.B7 | 49.75,6.81 49.74,6.82 48.43,5.51 46.36,5.51 45.17,6.69 32.43,6.69 29.65,9.48 29.65,10.1 31.02,11.46 31.02,16.85 30.19,17.68 30.19,21.34 33.76,24.92 33.76,40.06 33.14,40.68 33.14,43.04 32.98,43.21 32.98,47.03 30.49,49.53 28.32,49.53 23.57,44.78 17.59,44.78 17.37,45 17.37,53.62 19.74,56 19.74,57.4 22.24,59.89 25.59,59.89 30.98,65.29 30.98,69.51 U5.23 | 49.75,6.81 49.87,6.69 50.63,6.69 50.75,6.82 J2.A7 | U5.23
DAT2
  Top 0.254: U$1.1 44.56,82.12 R1.2
EN  (via drill 0.35)
  Top 0.254: RESET.1 31.8,10.29 v31.8,15.43 | C54.1 31.8,10.84 v31.8,15.43 | R29.1 31.4,15.83 v31.8,15.43 | v27.06,85.75 25.86,84.55 U5.45
  Bottom 0.254: v31.8,15.43 28.36,15.43 16.18,27.61 16.18,29.3 9.23,36.25 9.23,66.3 10.88,67.94 10.88,69.05 17.03,75.2 17.03,76.53 26.25,85.75 v27.06,85.75
GND  (via drill 0.35)
  Top 0.254: 54.7,83.68 54.77,83.61 | U$1.6 50.25,82.86 50.25,80.32 54.69,80.32 54.69,82.26 v54.82,82.38 | 76.3,24.74 U3.2 76.3,24.26 v76.65,23.9 | C50.1 91.28,45.57 89.83,45.57 U7.6 89.43,45.97 88.43,45.97 v88.34,46.05 | Q17.7 Q17.6 Q17.5
  Top 0.508: v55.96,91.03 54.56,92.44 U$1.G2 | U$1.G4 38.12,93.37 v37.68,93.81 | U$1.G3 40.34,83.93 v40.34,85.94 | U$1.G1 54.77,83.86 54.77,83.61 54.82,83.56 v54.82,82.38 | R3.2 R4.1 49.32,11.27 47.46,11.27 D9.A 47.14,11.28 v46.15,11.28 | J2.S1 46.76,7.89 J2.A1_B12 46.44,8.75 v46.44,8.85 | J2.S2 54.25,7.89 J2.B1_A12 54.8,8.98 v54.95,8.98 | C9.2 C10.2 38.31,21.03 v38.31,19.65 | R25.1 41.83,24.85 43.32,23.36 46.24,23.36 R22.1 48.74,22.06 C1.2 48.87,22.07 49.87,23.08 51.08,23.08 51.52,22.63 51.52,22.48 R21.1 52.96,23.08 60.03,23.08 60.16,22.95 | R25.1 40.83,24.83 39.84,23.84 C3.2 | R25.1 40.6,25.07 40.6,26.12 40.47,26.25 v40.47,26.63 | U1.7 v44.53,17.62 | IC1.3 19.91,49.81 C37.1 18.75,47.33 v18.63,47.21 | R8.1 30.05,25.25 | S3.2 60.41,6.76 v60.41,8.47 | U7.25 87.58,46.05 v88.34,46.05 | U7.25 87.49,46.15 v87.49,46.92 | U7.25 87.47,46.05 v86.68,46.05
  Top 0.813: U$1.G1 v54.56,85.81 v54.57,85.81 | v54.82,82.38 56.98,80.23 v57.36,80.23 | C15.2 C16.2 57.38,19.77 v60.16,19.77 | v71.19,75.64 71.19,75.47 C7.1 | C29.1 75.27,79.6 v75.08,79.6 | v87.75,69.29 87.47,69.01 C36.2 | RESET.2 30.48,7.41 C54.2 28.02,9.86 27.39,9.86 26.88,9.35 BOOT.2 26.41,8.97 v25.61,8.97 | v27.89,25.12 27.89,25.04 Q3.2 30.08,25.16 R8.1
  Top 1.27: v60.16,19.77 60.16,22.95 60.16,26.38 v60.79,26.38 | v31.89,34.04 31.55,34.37 C43.2 C44.2 C45.2 C46.2 C55.2 24.85,27.52 v24.44,27.11 | v18.86,32.31 20.3,32.31 C38.2 C39.2 C40.2 C41.2 C42.2 26.98,38.99 v26.98,40.44 | J1.2 23.82,24.83 23.82,25.38 v23.2,26
  Bottom 0.508: J2.S1 J2.S3 | J2.S4 J2.S2
  other vias: 19.46,76.72 20.47,77.72 21.51,78.77 22.49,79.74 23.47,80.82 26.27,70.12 27.35,71.13 28.41,72.17 29.48,73.22 30.56,74.3 24.54,64.06 36.55,74.49 44.78,72.58 29.64,92.61 30.97,84.94 65.38,78.98 12.11,26.99 24.04,41.72 17.51,41.82 17.46,39.81 11.81,38.09 12.9,52.34 65.92,19.2 58.25,16.13 44.74,14.9 35.24,4.56 55.04,74.65 11.63,75.53 10.23,74.13 72.46,24.05 82.53,29.22 27.17,55.49 33.33,55.64 40.18,74.41 82.3,46.3 81.4,46.3 84.91,54.29 84.01,54.29 83.2,46.3 83.11,53.93 85.27,62.02 84.37,62.02 86.16,62.02 87.53,45.2 73.3,49.55 74.25,62.33 93.5,55.22 82.99,63.83 75.04,41.69 80.57,54.26 88.77,60.41 72.59,68.23 86.35,70.76 64.48,89.48 60.06,12.43 67.85,13.09 68.18,28.94 50.06,25.03 15.93,48.83 90.19,60.36 89.97,59.07 65.78,40.23 65.39,36.08 60.88,29.84 68.64,34.39 86.01,29.47 87.7,31.14 78.33,26.41
  pour Bottom (isolate 0.305, rank 2, no thermals): 47.83,-0.84 51.62,-0.92 55.4,-0.71 59.17,-0.22 62.88,0.54 66.53,1.58 70.09,2.89 73.54,4.45 76.86,6.28 80.04,8.34 83.06,10.63 90.12,17.68 90.12,17.68 90.13,17.69 92.36,20.62 94.38,23.7 96.16,26.92 97.71,30.27 99.01,33.71 100.06,37.24 100.86,40.84 101.39,44.48 101.65,48.16 101.65,51.84 101.39,55.51 100.86,59.16 100.06,62.76 99.01,66.29 97.71,69.73 96.16,73.07 94.37,76.29 92.36,79.38 90.12,82.3 90.12,82.31 90.12,82.32 90.11,82.32 90.11,82.33 83.07,89.37 80.05,91.67 76.87,93.73 73.54,95.56 70.08,97.13 66.52,98.44 62.87,99.48 59.16,100.25 55.4,100.73 51.61,100.94 47.81,100.86 44.04,100.5 40.3,99.87 36.62,98.95 33.01,97.76 29.51,96.31 26.12,94.6 22.87,92.65 19.77,90.46 16.85,88.04 14.11,85.41 11.57,82.59 9.26,79.58 7.17,76.42 5.33,73.1 3.73,69.66 2.4,66.1 1.34,62.46 0.55,58.75 0.03,54.99 0.03,45.08 0.04,45.07 0.04,45.07 0.05,45.07 0.05,45.06 0.06,45.06 0.07,45.05 0.07,45.05 0.07,45.04 0.08,45.03 0.08,45.02 0.08,45.02 0.08,45.01 0.59,41.26 1.38,37.55 2.45,33.91 3.78,30.36 5.37,26.92 7.21,23.6 9.3,20.43 11.61,17.43 14.14,14.61 16.88,11.98 19.8,9.57 22.9,7.38 26.15,5.42 29.53,3.71 33.03,2.26 36.64,1.07 40.32,0.16 44.05,-0.48
  pour Top (isolate 0.254, no thermals): 81.87,64.05 83.55,64.05 74.2,73.34 73.39,72.52
  pour Top (no thermals): 77.4,76.71 86.01,68.1 86.83,68.83 78.23,77.43 78.11,77.43
  pour Top (isolate 0.406, rank 2, no thermals): -1.4,-8.9 103.65,-8.9 103.65,110.62 -1.16,110.62 -1.4,-7.31
  pour Top (no thermals): 81.51,45.26 81.49,45.21 80.75,44.47 80.83,44.39 82.02,45.57 82.05,45.6 82.1,45.62 82.95,45.62 83.51,46.19 83.51,46.45 83.33,46.63 81.32,46.63 81.12,46.43 81.12,46.11 81.49,45.74 81.51,45.7
  pour Top (no thermals): 83.41,53.25 83.43,53.2 83.43,53.14 83.41,53.09 83.37,53.05 82.89,52.57 82.97,52.48 84.02,53.54 84.06,53.57 84.1,53.59 84.67,53.59 85.23,54.15 85.23,54.45 85.09,54.59 83.81,54.59 83.49,54.28 83.45,54.26 83.05,54.26 82.84,54.05 82.84,53.81
HIN1
  Top 0.254: JP2.1 74.13,35.64 R9.2 | 74.09,36.4 JP2.1 | JP2.1 74.09,37.66 75.14,38.71 81.18,38.71 82.83,40.36 84.22,40.36 85.86,42 85.87,42.01 85.87,44.09 U7.22
HIN2
  Top 0.254: R10.2 76.56,35.61 JP2.2 76.63,37.41 77.54,38.33 81.33,38.33 82.93,39.93 84.49,39.93 86.25,41.69 86.25,41.78 86.25,41.95 86.27,41.96 86.27,43.75 86.27,43.78 U7.23
HIN3
  Top 0.254: 79.17,36.51 JP2.3 79.17,36.98 80.13,37.95 81.49,37.95 83.02,39.47 84.58,39.47 87.04,41.94 U7.24
HO1
  Top 0.254: U7.19 85.21,45.55 85.18,45.55 84.82,45.18 84.82,43.29 85.11,42.99 85.11,42.33 83.94,41.16 83.19,41.16 Q4.1
HO2
  Top 0.254: Q16.1 84.38,48.9 U7.16
HO3
  Top 0.254: Q17.1 89.52,53.15 89.52,50.65 88.07,49.2 87.89,49.2 U7.13
INV-IO18
  Top 0.254: R11.1 81.72,31.31 R10.1 75.64,30.38 75.64,28.54 75.65,28.53 U3.6
IO0  (via drill 0.35)
  Top 0.254: v28.62,18.29 30.53,16.39 30.53,13.09 BOOT.1 | v12.18,68.16 12.75,68.73 14.03,68.73 17.61,72.31 17.61,72.69 U5.4
  Bottom 0.254: v12.18,68.16 11.63,68.16 9.74,66.27 9.74,36.28 27.77,18.24 28.57,18.24 v28.62,18.29
IO1
  Top 0.254: J4.12 7.55,63.97 10.25,66.67 11.87,66.67 13.54,68.35 14.19,68.35 16.73,70.89 17,70.89 17.78,71.67 18.34,72.23 U5.5
IO2  (via drill 0.35)
  Top 0.254: 40.54,11.22 R28.1 40.65,11.44 v39.63,12.46 | J4.11 6.35,61.43 11.22,66.29 12.02,66.29 13.7,67.97 14.35,67.97 16.89,70.51 17.85,70.51 U5.6
  Bottom 0.254: J4.11 6.43,61.43 7.58,60.29 7.58,37.36 15.8,29.14 15.8,27.07 29.67,13.2 35.39,13.2 36.13,12.46 v39.63,12.46
IO3
  Top 0.254: 5.55,59.27 J4.10 8.09,61.81 8.09,62.63 11.37,65.91 12.83,65.91 17.05,70.13 18.72,70.13 19.57,70.97 U5.7
IO4
  Top 0.254: J4.9 8.47,59.65 8.47,62.47 11.53,65.53 12.99,65.53 16.88,69.42 19.16,69.42 U5.8
IO5
  Top 0.254: J4.8 8.85,57.49 8.85,62.31 11.69,65.15 13.15,65.15 16.74,68.75 19.69,68.75 U5.9
IO6
  Top 0.254: J4.7 9.23,55.33 9.23,62.15 11.85,64.77 13.57,64.77 16.92,68.12 20.27,68.12 U5.10 | U5.10
IO7
  Top 0.254: J4.6 9.61,53.17 9.61,61.99 12,64.39 13.73,64.39 16,66.66 | 16.01,66.67 16,66.66 | 16,66.66 17.06,67.72 21.09,67.72 21.97,68.6 U5.11
IO8
  Top 0.254: J4.5 9.99,51.01 9.99,61.58 12.42,64.01 13.89,64.01 17.21,67.34 21.89,67.34 U5.12
IO9
  Top 0.254: J4.4 10.37,48.85 10.37,61.32 12.68,63.63 14.12,63.63 17.34,66.85 22.68,66.85 23.17,67.34 | 23.05,67.23 22.86,67.05 22.88,67.05 23.17,67.34 | U5.13 23.17,67.34
IO10
  Top 0.254: J4.3 10.75,46.69 10.75,61.14 12.86,63.25 14.47,63.25 17.45,66.22 23.2,66.22 23.77,66.79 U5.14
IO11
  Top 0.254: J4.2 11.13,44.53 11.13,59.37 17.45,65.68 19.39,65.68 19.58,65.68 23.8,65.68 23.95,65.84 24.34,66.22 U5.15
IO12
  Top 0.254: J4.1 11.51,42.38 11.51,56.63 17.53,62.65 24.57,62.65 26.65,64.73 26.65,65.49 26.3,65.84 25.92,66.22 U5.16
IO13  (via drill 0.35)
  Top 0.254: v14.31,57.75 14.31,58.89 17.69,62.27 24.73,62.27 27.28,64.81 27.28,66.02 26.89,66.4 26.47,66.82 U5.17
  Bottom 0.254: v14.31,57.75 14.31,54.74 21.34,47.71 22.14,47.71 26.24,43.62 26.24,42.64 29.77,39.11 29.77,38.17 40.13,27.81 41.61,27.81 47.96,21.46 58.41,21.46 59.9,22.95 64.91,22.95 69.84,18.02 69.84,11.17 J5.12
IO14  (via drill 0.35)
  Top 0.254: v15.32,56.6 15.11,56.82 15.11,58.04 18.95,61.89 24.89,61.89 27.73,64.73 27.73,66.79 27.45,67.06 27.1,67.42 U5.18
  Bottom 0.254: 15.32,54.45 v15.32,56.6 | 15.32,54.45 15.32,54.32 | J5.11 73.74,10.85 73.74,15.23 65.49,23.49 59.07,23.49 57.71,22.12 47.83,22.12 41.77,28.19 40.29,28.19 30.15,38.33 30.15,39.27 26.62,42.8 26.62,43.77 22.3,48.09 21.67,48.09 15.32,54.45
IO15  (via drill 0.35)
  Top 0.254: v16.09,57.87 16.6,58.38 16.6,58.95 19.15,61.51 25.04,61.51 28.42,64.88 28.42,67.25 28.14,67.53 | 28.14,67.53 28.02,67.65 | 28.14,67.53 27.66,68.01 U5.19
  Bottom 0.254: v16.09,57.87 16.09,54.83 19.77,51.14 19.77,50.54 21.83,48.48 22.45,48.48 27,43.93 27,42.95 30.53,39.42 30.53,38.48 40.44,28.57 41.93,28.57 47.51,22.98 57.52,22.98 59.04,24.51 65.87,24.51 76.48,13.9 J5.10
IO16  (via drill 0.35)
  Top 0.254: v16.85,56.35 16.98,56.48 16.98,58.31 19.79,61.12 25.2,61.12 29.09,65.02 29.09,67.79 U5.20
  Bottom 0.254: v16.85,56.35 16.85,54.95 19.52,52.29 19.9,52.29 20.28,51.91 20.28,50.63 22.06,48.86 22.61,48.86 27.38,44.09 27.38,43.11 30.91,39.58 30.91,38.64 40.6,28.95 42.08,28.95 47.54,23.49 57.36,23.49 58.89,25.02 66.76,25.02 J5.9
IO17  (via drill 0.35)
  Top 0.254: U5.21 29.74,68.35 29.74,65.12 25.36,60.74 20.48,60.74 v17.74,58 | R13.1 22.01,50.89 IC1.2 21.95,51.65 v19.88,53.71
  Bottom 0.254: v17.74,58 17.61,57.87 17.61,55.63 19.33,53.91 19.66,53.58 | 19.66,53.58 20.66,52.58 20.66,51.14 22.55,49.26 23.96,49.26 | 24,49.24 23.98,49.26 23.96,49.26 | J5.8 79.46,15.91 79.46,27.27 75.9,30.82 59.39,30.82 57.62,29.05 42.53,29.05 42.24,29.33 40.76,29.33 31.29,38.8 31.29,39.74 27.76,43.27 27.76,44.25 24.25,47.76 24.25,48.96 23.96,49.26 | v19.88,53.71 19.75,53.58 19.66,53.58
IO18  (via drill 0.35)
  Top 0.152: 75.71,25.37 U3.1
  Top 0.254: U5.22 30.44,68.85 30.44,65.28 25.52,60.36 21.48,60.36 18.89,57.77 v18.89,56.98 | U5.22 | 75.6,23.38 75.6,23.36 | 75.6,23.36 75.71,23.25 77.37,21.59 | 77.37,21.59 J5.7 | 75.6,23.36 75.6,25.38 U3.1 75.39,25.43 74.3,26.52 74.13,26.7 R9.1 | 77.37,21.59 84.27,28.49 R12.1
  Bottom 0.254: J5.7 81.24,17.72 81.24,26.03 76.03,31.24 58.78,31.24 57.25,29.71 40.92,29.71 31.67,38.96 31.67,39.9 28.14,43.43 28.14,44.41 24.63,47.91 24.63,49.14 24.1,49.67 22.76,49.67 21.04,51.4 21.04,53.99 18.89,56.13 v18.89,56.98
IO21  (via drill 0.35)
  Top 0.254: R18.2 51.16,81.31 U$1.7 51.16,83.89 v50.76,84.29 | 32.5,70.39 | v32.5,70.11 32.5,70.27 32.5,70.39 | U5.25 32.5,70.39
  Bottom 0.254: v50.76,84.29 50.76,79.97 47.88,77.1 39.28,77.1 39.27,77.09 37.69,77.09 32.5,71.9 v32.5,70.11
IO33  (via drill 0.35)
  Top 0.254: v21.22,55.59 20.91,55.89 20.91,56.47 21.32,56.88 23.65,56.88 35.31,68.54 35.31,71.2 33.55,72.96 33.08,73.43 U5.28
  Bottom 0.254: J5.6 82.52,20.04 82.52,25.29 76.19,31.62 58.62,31.62 57.1,30.09 42.01,30.09 28.52,43.59 28.52,44.56 25.01,48.07 25.01,49.3 24.18,50.13 22.85,50.13 21.42,51.55 21.42,55.52 21.35,55.59 v21.22,55.59
IO34  (via drill 0.35)
  Top 0.254: v22.39,54.57 22.39,56.06 22.83,56.5 23.81,56.5 35.69,68.38 35.69,72.02 34.09,73.62 33.68,74.03 U5.29
  Bottom 0.254: v22.39,54.57 21.8,53.99 21.8,51.91 23.2,50.51 24.34,50.51 | 24.34,50.51 24.49,50.51 | J5.5 83.8,22.34 83.8,24.54 76.34,32 58.46,32 56.94,30.48 42.17,30.48 31.24,41.41 31.24,41.86 29.37,43.73 29.37,44.26 25.4,48.23 25.4,49.45 24.34,50.51
IO35  (via drill 0.35)
  Top 0.254: J1.3 23.5,20.84 25.36,22.7 25.36,24.98 33,32.63 33,39.75 32.37,40.38 32.37,41.78 30.64,43.51 v30.64,44.04 | U5.31 34.37,76.12 34.81,76.55 35.75,76.55 37.86,74.44 37.86,70.02 23.5,55.65 v23.4,55.65
  Bottom 0.254: v23.4,55.65 23.4,52.26 25.78,49.88 25.78,48.39 30.41,43.76 | J5.4 77.36,32.38 58.3,32.38 56.78,30.86 42.42,30.86 31.97,41.3 31.97,42.18 31.46,42.69 31.46,42.7 30.41,43.76 | 30.41,43.76 30.41,43.81 v30.64,44.04
IO36  (via drill 0.35)
  Top 0.254: v32.22,43.01 32.36,43.01 32.75,42.61 32.75,40.54 33.38,39.9 33.38,25.68 R7.1 | 34.07,76.97 34.2,77.1 35.74,77.1 38.25,74.59 38.25,69.86 24.16,55.78 v24.16,54.48 | 34.07,76.97 | 34.07,76.97 33.93,76.97 U5.32
  Bottom 0.254: J5.3 80.57,32.76 58.15,32.76 56.62,31.24 44.74,31.24 34.55,41.42 33.8,41.42 v32.22,43.01 31.4,43.82 31.4,44.36 26.16,49.6 26.16,50.48 24.16,52.48 v24.16,54.48
IO37  (via drill 0.35)
  Top 0.254: 33.67,77.79 33.6,77.73 | 33.67,77.79 35.59,77.79 38.63,74.75 38.63,69.7 25.22,56.29 25.22,53.31 v25.23,53.3 | 33.67,77.79 33.54,77.79 U5.33
  Bottom 0.254: v25.23,53.3 25.23,53.08 26.54,51.77 26.54,49.99 32.75,43.78 33.04,43.78 33.49,43.33 33.49,43.03 44.89,31.62 56.46,31.62 57.99,33.14 83.2,33.14 83.44,32.9 84.03,32.9 J5.2
IO38  (via drill 0.35)
  Top 0.254: 34.23,78.33 32.93,78.33 32.52,77.92 U5.34 | 34.23,78.33 35.82,78.33 39.01,75.15 39.01,69.54 26.13,56.67 26.13,54.13 v26.92,53.34 | R2.2 45.55,82.94 U$1.2 45.66,84.33 v45.54,84.45 | 34.23,78.33 34.15,78.42 v34.15,79.19
  Bottom 0.254: v26.92,53.34 26.92,50.44 33.87,43.49 33.87,43.19 45.05,32 56.31,32 57.83,33.52 83.36,33.52 83.6,33.28 87.24,33.28 J5.1 | v34.15,79.19 36.19,79.19 37.66,77.71 44.9,77.71 45.54,78.35 v45.54,84.45
IO39  (via drill 0.35)
  Top 0.254: R17.2 48.96,81.6 U$1.5 48.86,83.15 48.98,83.27 v48.98,84.8 | J6.8 85.43,79.34 81.49,79.34 78.89,81.94 76.1,81.94 75.82,82.22 67.23,82.22 61.3,76.29 54.69,76.29 v54,76.99 53.93,77.05 40.71,77.05 40.06,77.7 37,77.7 34.41,80.29 33.7,80.29 32.33,78.91 31.93,78.52 U5.35
  Bottom 0.254: v48.98,84.8 48.98,84.92 49.23,85.18 51.2,85.18 54,82.38 v54,76.99
IO40
  Top 0.254: J6.7 83.61,81.15 80.21,81.15 79.05,82.32 76.26,82.32 75.98,82.6 66.85,82.6 60.92,76.67 55.39,76.67 54.31,77.75 40.55,77.75 40.22,78.08 37.15,78.08 34.13,81.1 33.3,81.1 31.73,79.53 31.32,79.12 U5.36
IO41
  Top 0.254: J6.6 81.86,82.88 76.24,82.88 76.14,82.98 66.69,82.98 60.76,77.05 55.54,77.05 54.47,78.13 40.71,78.13 40.38,78.46 37.32,78.46 34.15,81.64 32.64,81.64 31.16,80.16 30.73,79.72 U5.37
IO42
  Top 0.254: 46.82,83.11 U$1.3 46.76,81.9 R16.2 47.46,81.11 46.69,80.35 41.93,80.35 40.49,78.91 | 40.49,78.91 40.58,78.91 40.98,78.51 54.63,78.51 55.7,77.43 60.54,77.43 66.47,83.36 78.73,83.36 J6.5 | 40.49,78.91 40.39,78.91 40.32,78.84 37.48,78.84 34.29,82.03 31.81,82.03 30.54,80.76 30.1,80.32 U5.38
IO47  (via drill 0.35)
  Top 0.254: 34.34,70.96 v34.34,70.84 34.34,71.01 32.52,72.83 U5.27
  Bottom 0.254: 55.08,80.61 55.08,80.48 | 55.08,80.48 55.08,78.07 55.2,77.94 55.2,76.42 54.57,75.78 39.9,75.78 37.03,72.91 36.41,72.91 v34.34,70.84 | 55.08,80.48 60.41,85.81 77.59,85.81 J6.4
IO48  (via drill 0.35)
  Top 0.254: 35.61,73.29 v35.71,73.29 34.37,74.63 U5.30
  Bottom 0.254: J6.3 76.67,88.48 74.63,86.45 60.28,86.45 54.69,80.86 54.69,77.81 54.82,77.69 54.82,76.57 54.41,76.16 53.58,76.16 53.28,76.46 40.05,76.46 36.88,73.29 v35.71,73.29
LIN1
  Top 0.254: R11.2 81.73,35.65 JP2.4 | JP2.4 81.71,37.25 | U7.1 88.02,42.23 84.88,39.09 83.17,39.09 81.71,37.62 JP2.4
LIN2
  Top 0.254: R12.2 84.27,35.65 JP2.5 84.25,37.83 88.45,42.04 88.45,43.23 88.73,43.51 88.73,43.84 U7.2
LIN3
  Top 0.254: U7.3 89.11,44.17 89.11,43.5 89.11,43.22 89.05,43.16 88.84,42.95 88.84,42.01 88.84,41.26 86.94,39.36 86.79,39.2 JP2.6
LO1  (via drill 0.35)
  Top 0.254: v83.92,47.38 83.74,47.2 81.05,47.2 80.51,46.66 80.51,45.22 80.11,44.82 80.11,44.24 Q4.8 | v89.58,49.09 89.13,48.64 88.95,48.64 88.37,48.06 U7.11
  Bottom 0.254: v83.92,47.38 85,47.38 86.7,49.09 v89.58,49.09
LO2  (via drill 0.35)
  Top 0.254: Q16.8 82.21,52.2 82.21,54.11 83.29,55.19 85.27,55.19 88.09,52.37 v88.09,50.83 | v90.92,49 90.23,48.3 89.37,48.3 U7.10
  Bottom 0.254: v88.09,50.83 89.09,50.83 v90.92,49
LO3
  Top 0.254: Q17.8 83.07,59.67 82.85,59.88 82.85,60.68 83.47,61.3 83.47,62.56 84.43,63.52 86.51,63.18 86.94,62.75 86.94,60.59 88.89,58.64 88.89,55.21 91.74,52.37 91.74,48.54 91.03,47.84 89.62,47.84 U7.9
N$1
  Top 0.254: R27.2 42.81,9.28 LED3.A
  Top 0.508: 42.68,7.78 LED3.A
N$2
  Top 0.254: R23.2 39.42,8.6 LED4.A
N$3
  Top 0.508: 27.82,21.54 Q3.3
  Top 0.813: Q3.3 25.34,19.07 J1.4
N$4
  Top 0.254: J2.B5 52.25,9.43 R3.1
N$5
  Top 0.508: LED1.C | LED1.C LED3.C LED2.C | 40.97,5.67 LED2.C | LED5.C LED4.C LED2.C | LED1.C 45.45,4.66 47.07,4.66 47.58,4.15 47.58,2.88 48.73,1.74 55.09,1.74 56.5,3.15 57.19,3.15 57.7,3.66 S3.1
N$6
  Top 0.254: R28.2 41.09,8.97 LED2.A
N$7
  Top 0.508: U1.3 53.34,18.89 R19.2 53.64,19.27 R21.2
N$8
  Top 0.508: C1.1 50.62,20.86 U1.4
N$9
  Top 0.254: R20.2 52.26,82.11 U$1.8
N$10
  Top 0.508: U1.6 44.66,18.89 42.11,21.44 C2.1 C3.1
N$11
  Top 0.61: C2.2 42.52,23.19 43.65,22.06 R22.2
N$12
  Top 0.508: R8.2 31.41,26.33 31.41,23.92 R7.2 31.43,23.82 Q3.1
N$13
  Top 0.254: R5.2 44.72,7.82 LED1.A
N$14
  Top 0.254: R6.2 37.69,8.3 LED5.A
N$16
  Top 0.254: R24A.1 36.03,26.48 R24B.2
N$30
  Top 0.508: C4.2 51.32,15.13 U1.1
N$35
  Top 0.508: R19.1 53.59,17.62 U1.2
  Top 0.813: D10.C 57.7,17.5 C16.1 C15.1 53.7,17.5 R19.1
N$80
  Top 0.254: R4.2 49.25,9.42 J2.A5
PH
  Top 0.508: C4.1 47.91,14.82 U1.8 47.54,15.19 47.54,14.58 D9.C
  Top 0.813: U1.8 44.6,16.34
  Top 1.27: 44.6,16.34 42.19,16.34 L2.1
RXD0
  Top 0.254: J6.1 65.17,84.17 63.89,84.17 | 63.89,84.17 61.54,84.17 58.11,87.59 53.9,87.59 52.76,86.45 44.88,86.45 41.74,83.31 41.74,81.23 40.17,79.67 40.07,79.67 40.01,79.6 37.89,79.6 34.65,82.84 30.19,82.84 U5.40 | JP4.1 57.09,92.75 59.46,90.39 63.89,85.95 63.89,84.17
SD  (via drill 0.35)
  Top 0.254: U$1.4 47.86,82.46 48.51,81.81 48.51,79.8 48.22,79.5 | 53.89,79.5 56.18,79.5 v56.35,79.34 | 49.61,3.01 v49.61,3.14 50.99,4.51 54.45,4.51 70.98,21.03 v70.98,34.98 | R6.1 v34.83,11.11 v34.83,11.12
  Top 0.508: R20.1 53.89,79.5 | S4.2 37.76,88.52 38.67,87.62 v38.67,80.75 | v42.25,79.59 43.56,79.59 R1.1
  Top 0.813: R1.1 R2.1 R16.1 48.22,79.5 R17.1 R18.1 R20.1
  Bottom 0.254: v70.98,34.98 70.42,34.98 67.36,38.03 67.36,57.78 56.35,68.8 v56.35,79.34 | v34.83,11.12 34.83,10.05 43.31,1.57 48.16,1.57 49.61,3.02 v49.61,3.14
  Bottom 0.508: v38.67,80.75 41.09,80.75 v42.25,79.59
TXD0  (via drill 0.35)
  Top 0.254: J6.2 71.87,90.09 65.57,83.78 61.38,83.78 57.96,87.21 57.18,87.21 | 57.18,87.21 54.06,87.21 52.91,86.06 45.04,86.06 42.12,83.15 42.12,81.08 40.33,79.29 40.23,79.29 40.16,79.22 37.64,79.22 37.57,79.29 | 37.57,79.29 34.4,82.46 31.04,82.46 29.5,80.92 U5.39 | 37.49,79.37 37.57,79.29 | v57.02,86 57.02,87.05 57.18,87.21
  Bottom 0.254: JP4.2 59.63,88.62 v57.02,86
VB1
  Top 0.254: D7.C 79.45,40.05 C51.1 80.84,40.76 84.08,40.76 85.49,42.17 85.49,43.16 85.2,43.46 85.2,44.83 U7.20
VB2
  Top 0.254: 81.78,48.02 D8.C 81.78,48.13 C52.1 83.3,49.27 U7.17
VB3
  Top 0.254: C53.1 82.59,55.77 D11.C 85.28,55.71 88.85,52.15 88.85,50.52 87.92,49.58 87.32,49.58 86.43,48.69 86.43,48.27 U7.14
VBUS  (via drill 0.35)
  Top 0.254: J2.B4_A9 52.9,8.59 53.42,9.11 | J2.A4_B9 48.1,9.09 v47.84,9.36 | R27.1 42.68,11.96 41.97,12.66 v41.68,12.66
  Top 0.508: v53.68,9.36 53.42,9.11
  Top 0.813: D3.A 34.59,14.78 34.59,13.8 34.69,13.7 v36.18,13.7
  Bottom 0.254: v47.84,9.36 v53.68,9.36 | v41.68,12.66 41.68,13.61 41.6,13.69
  Bottom 0.813: v47.84,9.36 47.63,9.56 47.63,12 45.94,13.69 41.6,13.69 36.19,13.69 v36.18,13.7
VCC  (via drill 0.35)
  Top 0.254: R23.1 38.6,12.6 39.65,13.65 45.5,13.65 45.99,13.16 51.57,13.16 | D7.A 77.98,41.28 78.39,40.86 79.01,40.86 80.33,42.17 81.58,42.17 Q4.9 | D8.A 80.49,49.55 80.96,49.09 81.45,49.09 82.74,50.37 83.86,50.37 Q16.9 | D11.A 81.67,56.63 82.21,56.63 83.65,58.07 84.55,58.07 Q17.9 | U7.4 90.07,43.92 C50.2
  Top 0.508: D10.A 61.17,18.5 59.9,17.23 59.9,15.84 58.89,14.82 53.24,14.82 51.57,13.16
  Top 0.813: 21.77,29.64 21.38,30.02 v21.15,30.02
  Top 1.016: C50.2 90.26,43.26 v89.77,42.77
  Top 1.27: D10.A 61.99,18.89 61.99,25.6 62.95,26.56 62.95,27.98 62.95,28.2 | v70.24,36.74 68.33,36.74 62.95,31.36 62.95,28.2 | J1.1 21.77,26.32 21.77,29.64 23.3,31.17 | 29.26,37.45 27.92,36.12 27.87,36.12 | 62.95,28.2 37.57,28.2 v36.9,28.87
  Bottom 0.508: 89.1,42.47 89.79,42.47 90.09,42.77 | 90.09,42.77 90.57,43.25 89.71,43.25 | 90.09,42.77 v89.77,42.77
  Bottom 0.813: v85.58,49.95 85.06,50.47 85.06,50.53
  Bottom 1.27: 36.77,28.74 v36.9,28.87 28.38,28.87 26.22,31.03 22.16,31.03 v21.15,30.02 | v70.24,36.74 71.8,38.3 84.01,38.3 85.31,38.3 v89.77,42.77
  Bottom 2.54: 87.21,57.6 v86.24,57.6 89.19,54.66 | 89.19,54.66 91.97,51.88 | 91.97,51.88 92.84,51 92.84,46.38 89.71,43.25 | v83.58,41.92 84.1,42.43 89.13,42.43 89.1,42.47 | 85.06,50.53 89.19,54.66 | 89.19,54.66 96.56,62.04 JP3.1 JP3.2 JP3.3 96.76,52.82 | 96.76,52.82 97.05,52.53 | 91.97,51.88 95.82,51.88 96.76,52.82
  other vias: 84.35,42.67 86.32,50.68 87.02,58.35
  pour Top (no thermals): 95.01,56.89 95.02,56.86 95.02,52.22 95.96,51.27 97.7,51.27 99.61,53.18 99.61,67.18 93.11,73.69 92.78,73.69 90.98,71.89 90.98,69.12 90.97,69.1 89.24,67.37 89.22,67.36 85.43,67.36 85.4,67.37 74.96,77.81 72.99,75.83 73.01,75.83 73.04,75.82 84.13,64.73 86.12,64.64 86.12,64.64 86.14,64.63 86.15,64.63 86.15,64.63 86.15,64.63 86.16,64.63 86.18,64.62 86.18,64.62 86.18,64.62 86.19,64.61 86.2,64.6 86.2,64.6 88.39,62.14 89.74,62.14 89.76,62.13
  pour Top (no thermals): 23.33,29.59 23.4,29.59 29.67,35.86 27.75,37.79 21.5,31.42
  pour Top (no thermals): 84.6,42.76 84.07,43.29 84,43.29 83.95,43.31 83.32,43.94 82.33,42.95 83.61,41.66 83.63,41.66 84.6,42.63
  pour Top (no thermals): 84.37,50.99 85.66,49.7 86.58,50.62 86.58,50.78 85.37,51.99
  pour Top (no thermals): 84.94,58.64 86.3,57.28 87.38,58.37 87.38,58.38 86.04,59.72
VS1
  Top 0.254: Q4.10 82.81,45.09 83.96,45.09 85.27,46.4 U7.18
  pour Top (no thermals): 80.23,43.24 80.19,43.26 79.19,44.25 79.17,44.3 79.17,47.1 78.1,48.17 76.64,48.17 75.59,47.12 75.59,45.44 79.26,41.77 80.33,42.85 80.38,42.87 80.98,42.87 82.72,44.61 82.31,45.01 80.56,43.26 80.52,43.24
VS2
  Top 0.254: Q16.10 83.69,52 84.88,53.19 87.33,50.75 87.33,50.33 85.97,48.97 85.97,48.03 86.26,47.75 86.26,47.73 U7.15 | 82.2,50.51 C52.2
  pour Top (no thermals): 79.79,50.61 79.84,50.63 80.51,50.63 80.56,50.61 81.46,49.71 82.53,50.79 82.58,50.81 82.93,50.81 84.77,52.65 84.44,52.98 82.75,51.29 82.7,51.27 82.38,51.27 82.33,51.29 81.88,51.75 75.58,51.75 75.34,51.51 75.34,50.51 75.35,50.27 79.44,50.27
VS3
  Top 0.254: 82.94,58.15 C53.2 | Q17.10 85.77,60.98 88.51,58.23 88.51,54.83 90.28,53.06 90.28,50.86 88.82,49.4 88.82,49.16 U7.12
  pour Top (no thermals): 76.34,62.33 79.82,58.85 80.79,58.85 80.83,58.83 82.28,57.39 83.45,58.57 83.5,58.59 83.76,58.59 85.42,60.25 85.04,60.63 83.3,58.9 83.25,58.88 82.95,58.88 82.9,58.9 81.69,60.11 81.67,60.16 81.67,62.1 78.92,64.85 77.37,64.85 76.34,63.81
VSENSE
  Top 0.254: R24B.1 37.73,26.62 39.11,25.23 R25.2 38.82,24.56 38.82,22.44 38.95,22.31 42.38,22.31 44.53,20.16 U1.5

### Text on the board
tPlace: reLoaD Base | Nicklas Rondot | Dario Mager
tNames: RX | TX | GND | RXD | TXD | 48 | 47 | SD Card | 42 | 41 | 40 | 39 | GND | +3V3 | +5V | VCC | 1 | 2 | 3 | 4 | 5 | 6 | 7 | 8 | 9 | 10 | 11 | 12 | 12 | 38 | 37 | (S)36 | 35 | 34 | 33 | (W)18 | (H)17 | 16 | 15 | 14 | 13 | LEDs
bNames: RXD | TXD | 48 | 47 | 42 | 41 | 40 | 39 | GND | +3V3 | +5V | VCC | 1 | 2 | 3 | 4 | 5 | 6 | 7 | 8 | 9 | 10 | 11 | 12 | 12 | 38 | 37 | 36 | 35 | 34 | 33 | 18(W) | 17 | 16 | 15 | 14 | 13
tDocu: VCC | GND | DAT | MOSFET